# EAGLE design EIT (EAGLE 7.7.0)
DATABASE: /Users/jeanrintoul/Desktop/biomedicalimaging/EE/Eagle/EIT/partsdb.txt

## Sheet 1 of 8
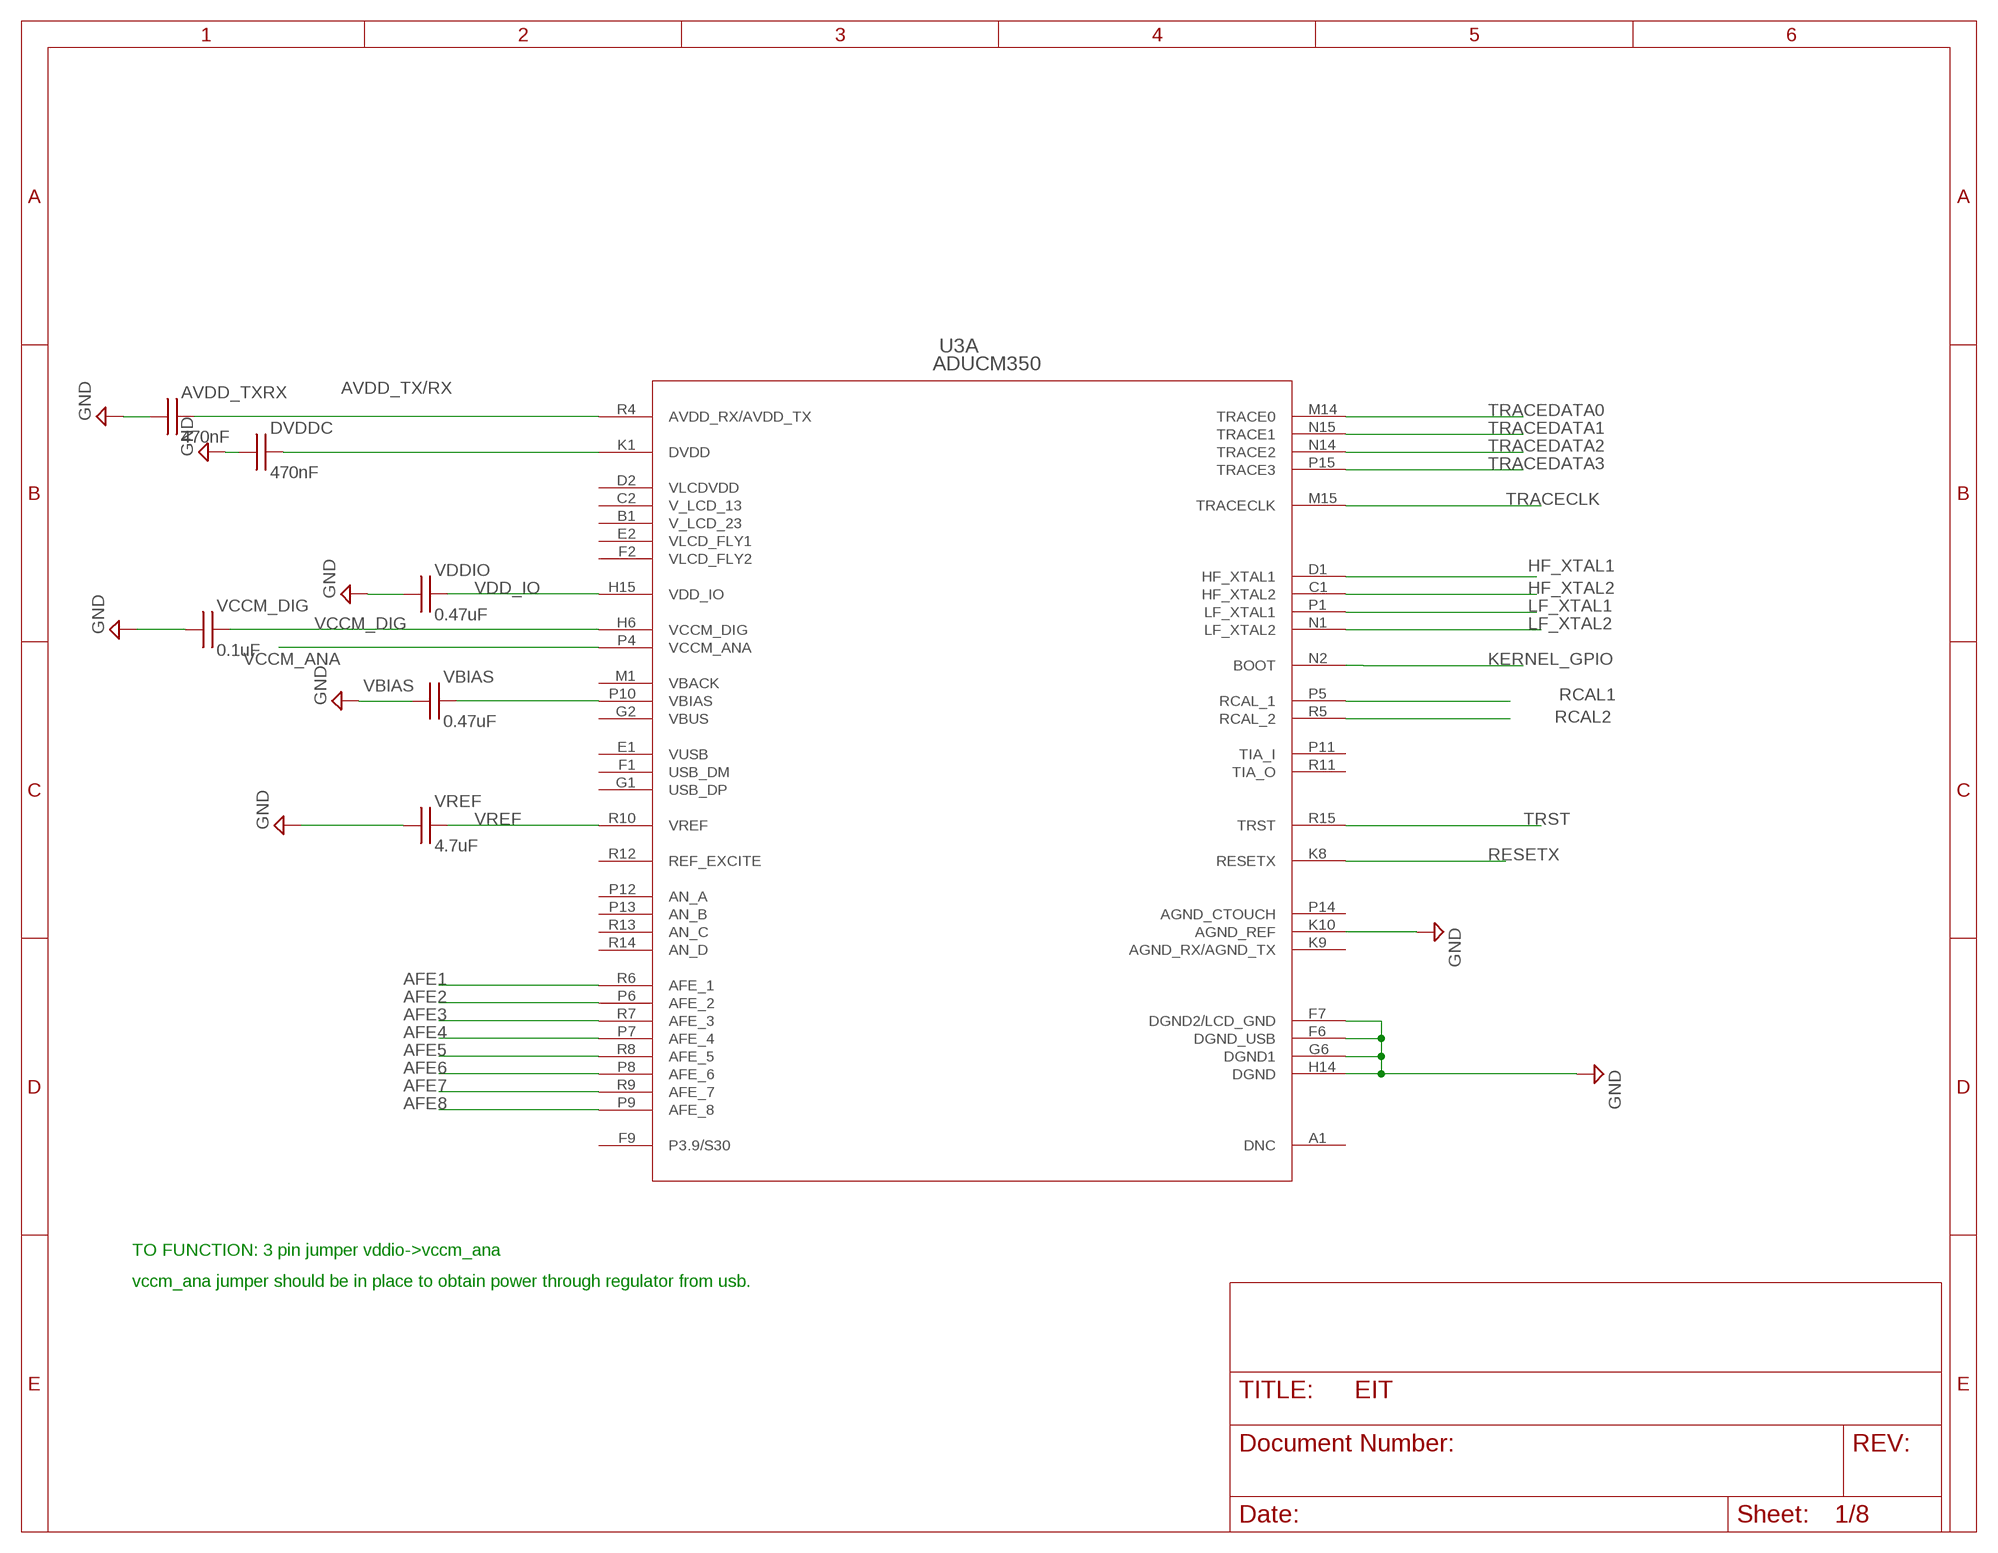
[diagram p0: schematic, sheet 1]

### Parts
AVDD_TXRX  470nF  CAPACITOR-NON-POLAR-0603  [CAPC1608X87N]
DVDDC  470nF  CAPACITOR-NON-POLAR-0603  [CAPC1608X87N]
U3  ADUCM350  [ADUCM350_DUNCAN]
VBIAS  0.47uF  CAPACITOR-NON-POLAR-0603  [CAPC1608X87N]
VCCM_DIG  0.1uF  CAPACITOR-NON-POLAR-0603  [CAPC1608X87N]
VDDIO  0.47uF  CAPACITOR-NON-POLAR-0603  [CAPC1608X87N]
VREF  4.7uF  CAPACITOR-NON-POLAR-0603  [CAPC1608X87N]

### Nets
AFE1: U3.R6(A:AFE_1) ; also sheet 6
AFE2: U3.P6(A:AFE_2) ; also sheet 6
AFE3: U3.R7(A:AFE_3) ; also sheet 5,6
AFE4: U3.P7(A:AFE_4) ; also sheet 5,6
AFE5: U3.R8(A:AFE_5) ; also sheet 6
AFE6: U3.P8(A:AFE_6) ; also sheet 6
AFE7: U3.R9(A:AFE_7) ; also sheet 6
AFE8: U3.P9(A:AFE_8) ; also sheet 6
AVDD_TX/RX: AVDD_TXRX.2 U3.R4(A:AVDD_RX/AVDD_TX)
GND: AVDD_TXRX.1 DVDDC.1 U3.F6(A:DGND_USB) U3.F7(A:DGND2/LCD_GND) U3.G6(A:DGND1) U3.H14(A:DGND) U3.K10(A:AGND_REF) VBIAS.1 VCCM_DIG.1 VDDIO.1 VREF.1 ; also sheet 3,4,5,6,7,8
HF_XTAL1: U3.D1(A:HF_XTAL1) ; also sheet 7
HF_XTAL2: U3.C1(A:HF_XTAL2) ; also sheet 7
KERNEL_GPIO: U3.N2(A:BOOT) ; also sheet 4
LF_XTAL1: U3.P1(A:LF_XTAL1) ; also sheet 7
LF_XTAL2: U3.N1(A:LF_XTAL2) ; also sheet 7
RCAL1: U3.P5(A:RCAL_1) ; also sheet 5
RCAL2: U3.R5(A:RCAL_2) ; also sheet 5
RESETX: U3.K8(A:RESETX) ; also sheet 4,8
TRACECLK: U3.M15(A:TRACECLK) ; also sheet 7
TRACEDATA0: U3.M14(A:TRACE0) ; also sheet 7
TRACEDATA1: U3.N15(A:TRACE1) ; also sheet 7
TRACEDATA2: U3.N14(A:TRACE2) ; also sheet 7
TRACEDATA3: U3.P15(A:TRACE3) ; also sheet 7
TRST: U3.R15(A:TRST) ; also sheet 7
VBIAS: U3.P10(A:VBIAS) VBIAS.2
VCCM_ANA: U3.P4(A:VCCM_ANA) ; also sheet 3,5,6,7
VCCM_DIG: U3.H6(A:VCCM_DIG) VCCM_DIG.2
VDD_IO: U3.H15(A:VDD_IO) VDDIO.2 ; also sheet 7
VLCDVDD: DVDDC.2 U3.K1(A:DVDD)
VREF: U3.R10(A:VREF) VREF.2
Unconnected: U3.A1(A:DNC) U3.B1(A:V_LCD_23) U3.C2(A:V_LCD_13) U3.D2(A:VLCDVDD) U3.E1(A:VUSB) U3.E2(A:VLCD_FLY1) U3.F1(A:USB_DM) U3.F2(A:VLCD_FLY2) U3.F9(A:P3.9/S30) U3.G1(A:USB_DP) U3.G2(A:VBUS) U3.K9(A:AGND_RX/AGND_TX) U3.M1(A:VBACK) U3.P11(A:TIA_I) U3.P12(A:AN_A) U3.P13(A:AN_B) U3.P14(A:AGND_CTOUCH) U3.R11(A:TIA_O) U3.R12(A:REF_EXCITE) U3.R13(A:AN_C) U3.R14(A:AN_D)

### Notes on the sheet
- TO FUNCTION: 3 pin jumper vddio->vccm_ana
- vccm_ana jumper should be in place to obtain power through regulator from usb.

## Sheet 2 of 8
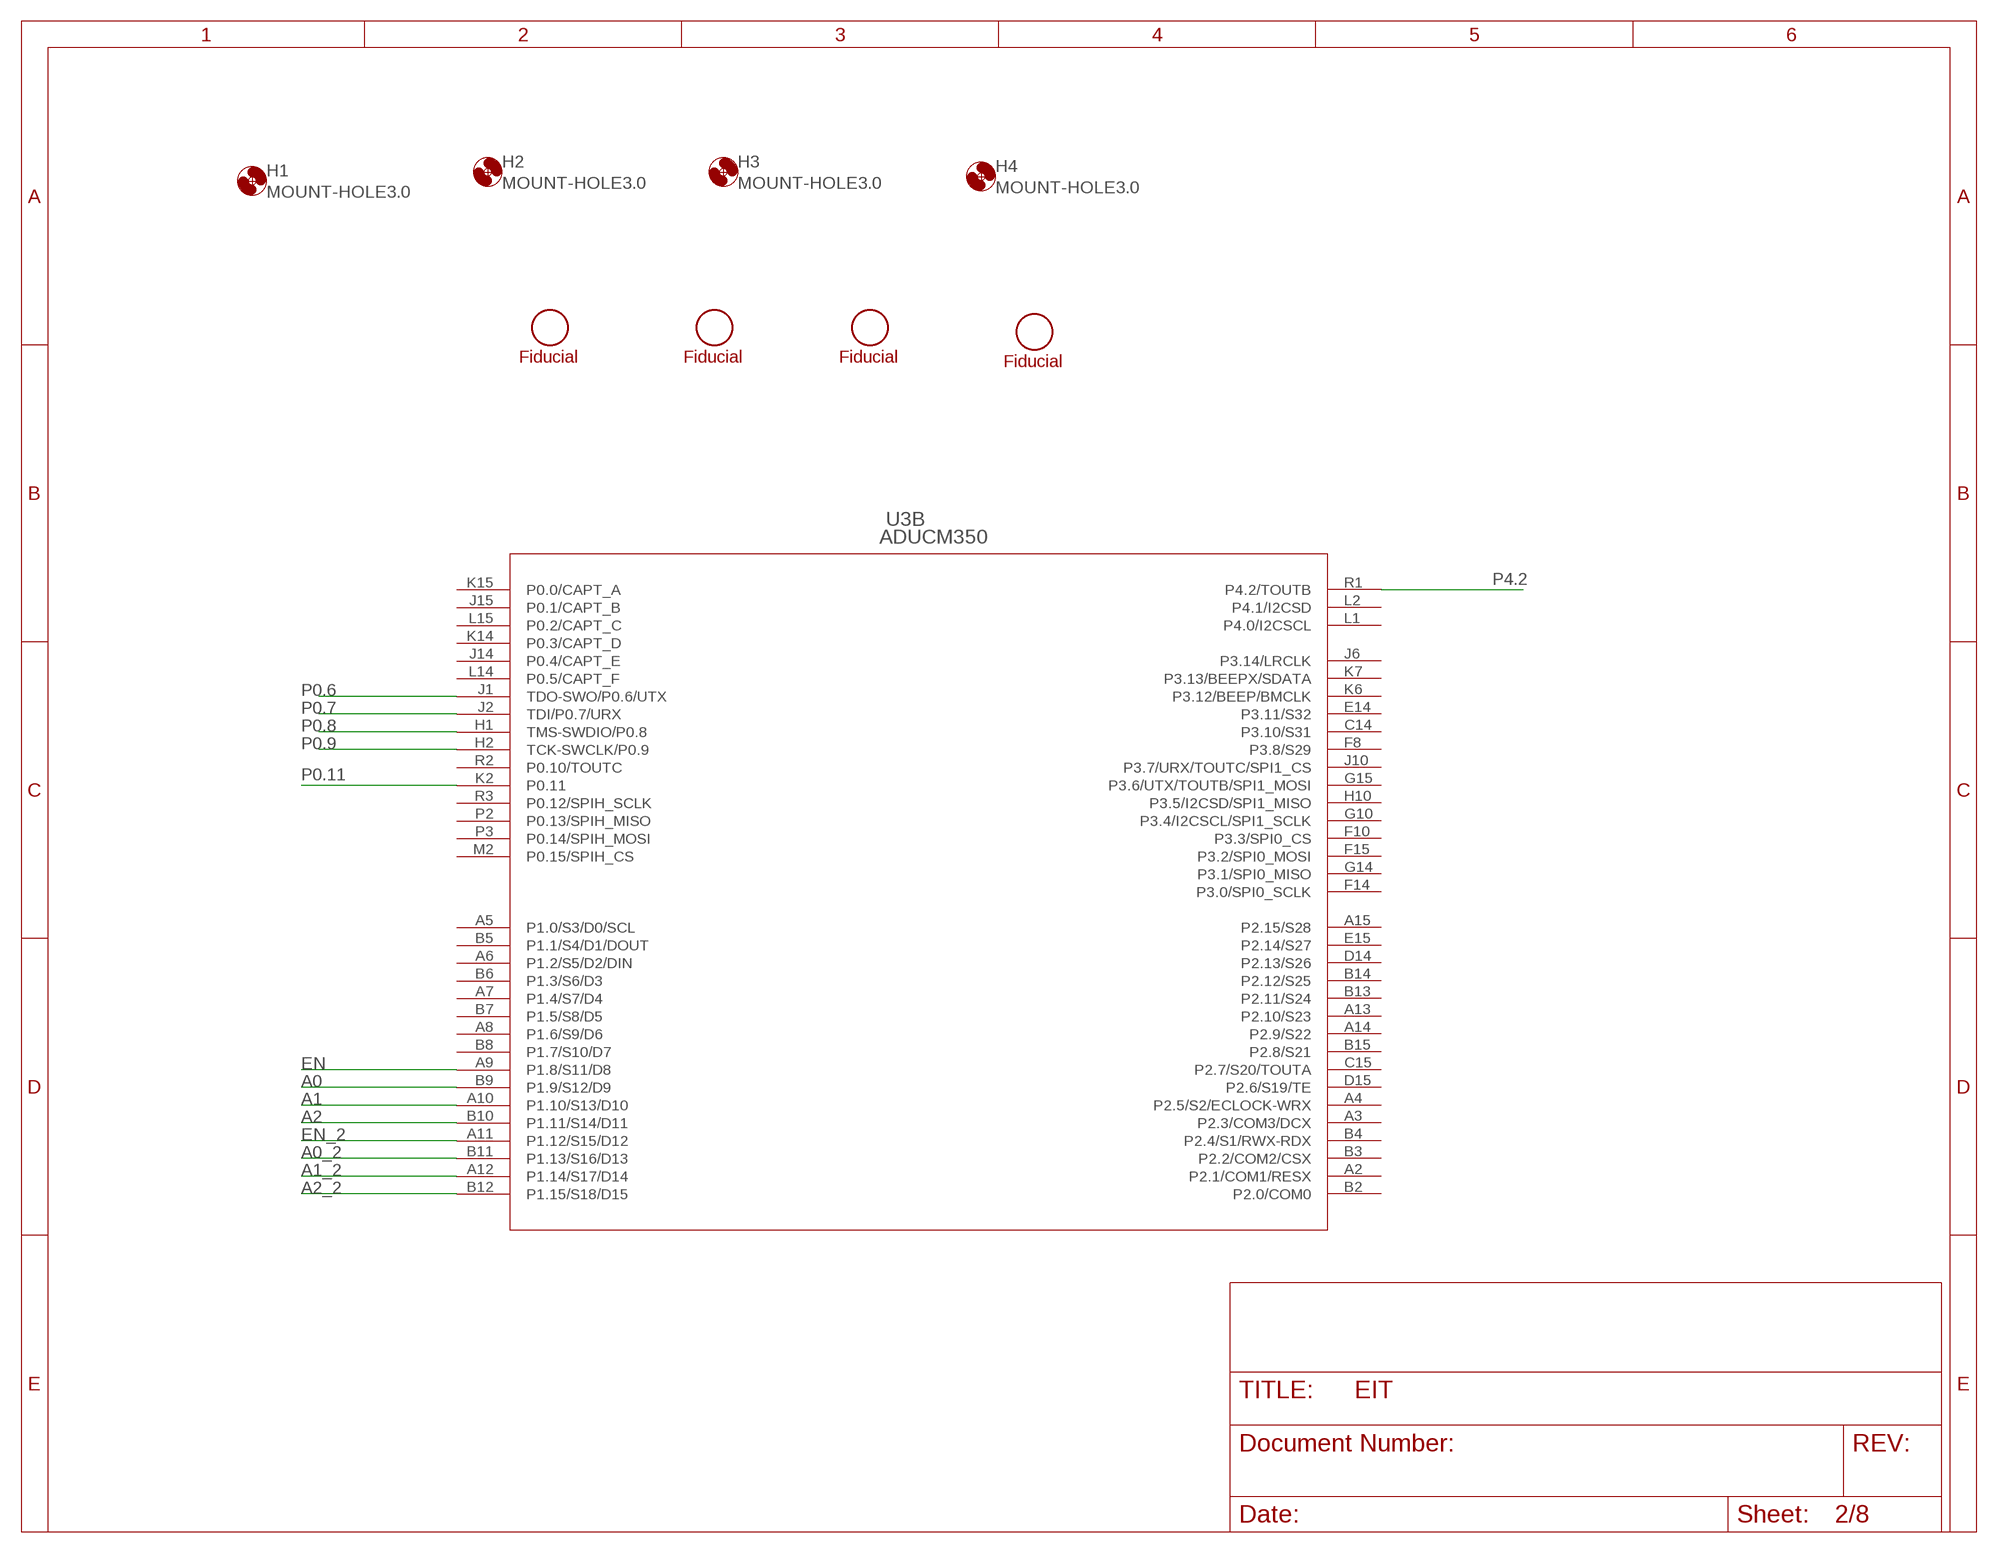
[diagram p1: schematic, sheet 2]

### Parts
F1  FIDUCIAL  [FIDUCIAL-1MM]
F2  FIDUCIAL  [FIDUCIAL-1MM]
F3  FIDUCIAL  [FIDUCIAL-1MM]
F4  FIDUCIAL  [FIDUCIAL-1MM]
H1  MOUNT-HOLE3.0  [3,0]
H2  MOUNT-HOLE3.0  [3,0]
H3  MOUNT-HOLE3.0  [3,0]
H4  MOUNT-HOLE3.0  [3,0]

### Nets
A0: U3.B9(B:P1.9/S12/D9) ; also sheet 5
A0_2: U3.B11(B:P1.13/S16/D13) ; also sheet 5
A1: U3.A10(B:P1.10/S13/D10) ; also sheet 5
A1_2: U3.A12(B:P1.14/S17/D14) ; also sheet 5
A2: U3.B10(B:P1.11/S14/D11) ; also sheet 5
A2_2: U3.B12(B:P1.15/S18/D15) ; also sheet 5
EN: U3.A9(B:P1.8/S11/D8) ; also sheet 5
EN_2: U3.A11(B:P1.12/S15/D12) ; also sheet 5
P0.6: U3.J1(B:TDO-SWO/P0.6/UTX) ; also sheet 4,7
P0.7: U3.J2(B:TDI/P0.7/URX) ; also sheet 4,7
P0.8: U3.H1(B:TMS-SWDIO/P0.8) ; also sheet 4,7
P0.9: U3.H2(B:TCK-SWCLK/P0.9) ; also sheet 4,7
P0.11: U3.K2(B:P0.11) ; also sheet 4
P4.2: U3.R1(B:P4.2/TOUTB) ; also sheet 4
Unconnected: U3.A2(B:P2.1/COM1/RESX) U3.A3(B:P2.3/COM3/DCX) U3.A4(B:P2.5/S2/ECLOCK-WRX) U3.A5(B:P1.0/S3/D0/SCL) U3.A6(B:P1.2/S5/D2/DIN) U3.A7(B:P1.4/S7/D4) U3.A8(B:P1.6/S9/D6) U3.A13(B:P2.10/S23) U3.A14(B:P2.9/S22) U3.A15(B:P2.15/S28) U3.B2(B:P2.0/COM0) U3.B3(B:P2.2/COM2/CSX) U3.B4(B:P2.4/S1/RWX-RDX) U3.B5(B:P1.1/S4/D1/DOUT) U3.B6(B:P1.3/S6/D3) U3.B7(B:P1.5/S8/D5) U3.B8(B:P1.7/S10/D7) U3.B13(B:P2.11/S24) U3.B14(B:P2.12/S25) U3.B15(B:P2.8/S21) U3.C14(B:P3.10/S31) U3.C15(B:P2.7/S20/TOUTA) U3.D14(B:P2.13/S26) U3.D15(B:P2.6/S19/TE) U3.E14(B:P3.11/S32) U3.E15(B:P2.14/S27) U3.F8(B:P3.8/S29) U3.F10(B:P3.3/SPI0_CS) U3.F14(B:P3.0/SPI0_SCLK) U3.F15(B:P3.2/SPI0_MOSI) U3.G10(B:P3.4/I2CSCL/SPI1_SCLK) U3.G14(B:P3.1/SPI0_MISO) U3.G15(B:P3.6/UTX/TOUTB/SPI1_MOSI) U3.H10(B:P3.5/I2CSD/SPI1_MISO) U3.J6(B:P3.14/LRCLK) U3.J10(B:P3.7/URX/TOUTC/SPI1_CS) U3.J14(B:P0.4/CAPT_E) U3.J15(B:P0.1/CAPT_B) U3.K6(B:P3.12/BEEP/BMCLK) U3.K7(B:P3.13/BEEPX/SDATA) U3.K14(B:P0.3/CAPT_D) U3.K15(B:P0.0/CAPT_A) U3.L1(B:P4.0/I2CSCL) U3.L2(B:P4.1/I2CSD) U3.L14(B:P0.5/CAPT_F) U3.L15(B:P0.2/CAPT_C) U3.M2(B:P0.15/SPIH_CS) U3.P2(B:P0.13/SPIH_MISO) U3.P3(B:P0.14/SPIH_MOSI) U3.R2(B:P0.10/TOUTC) U3.R3(B:P0.12/SPIH_SCLK)

## Sheet 3 of 8
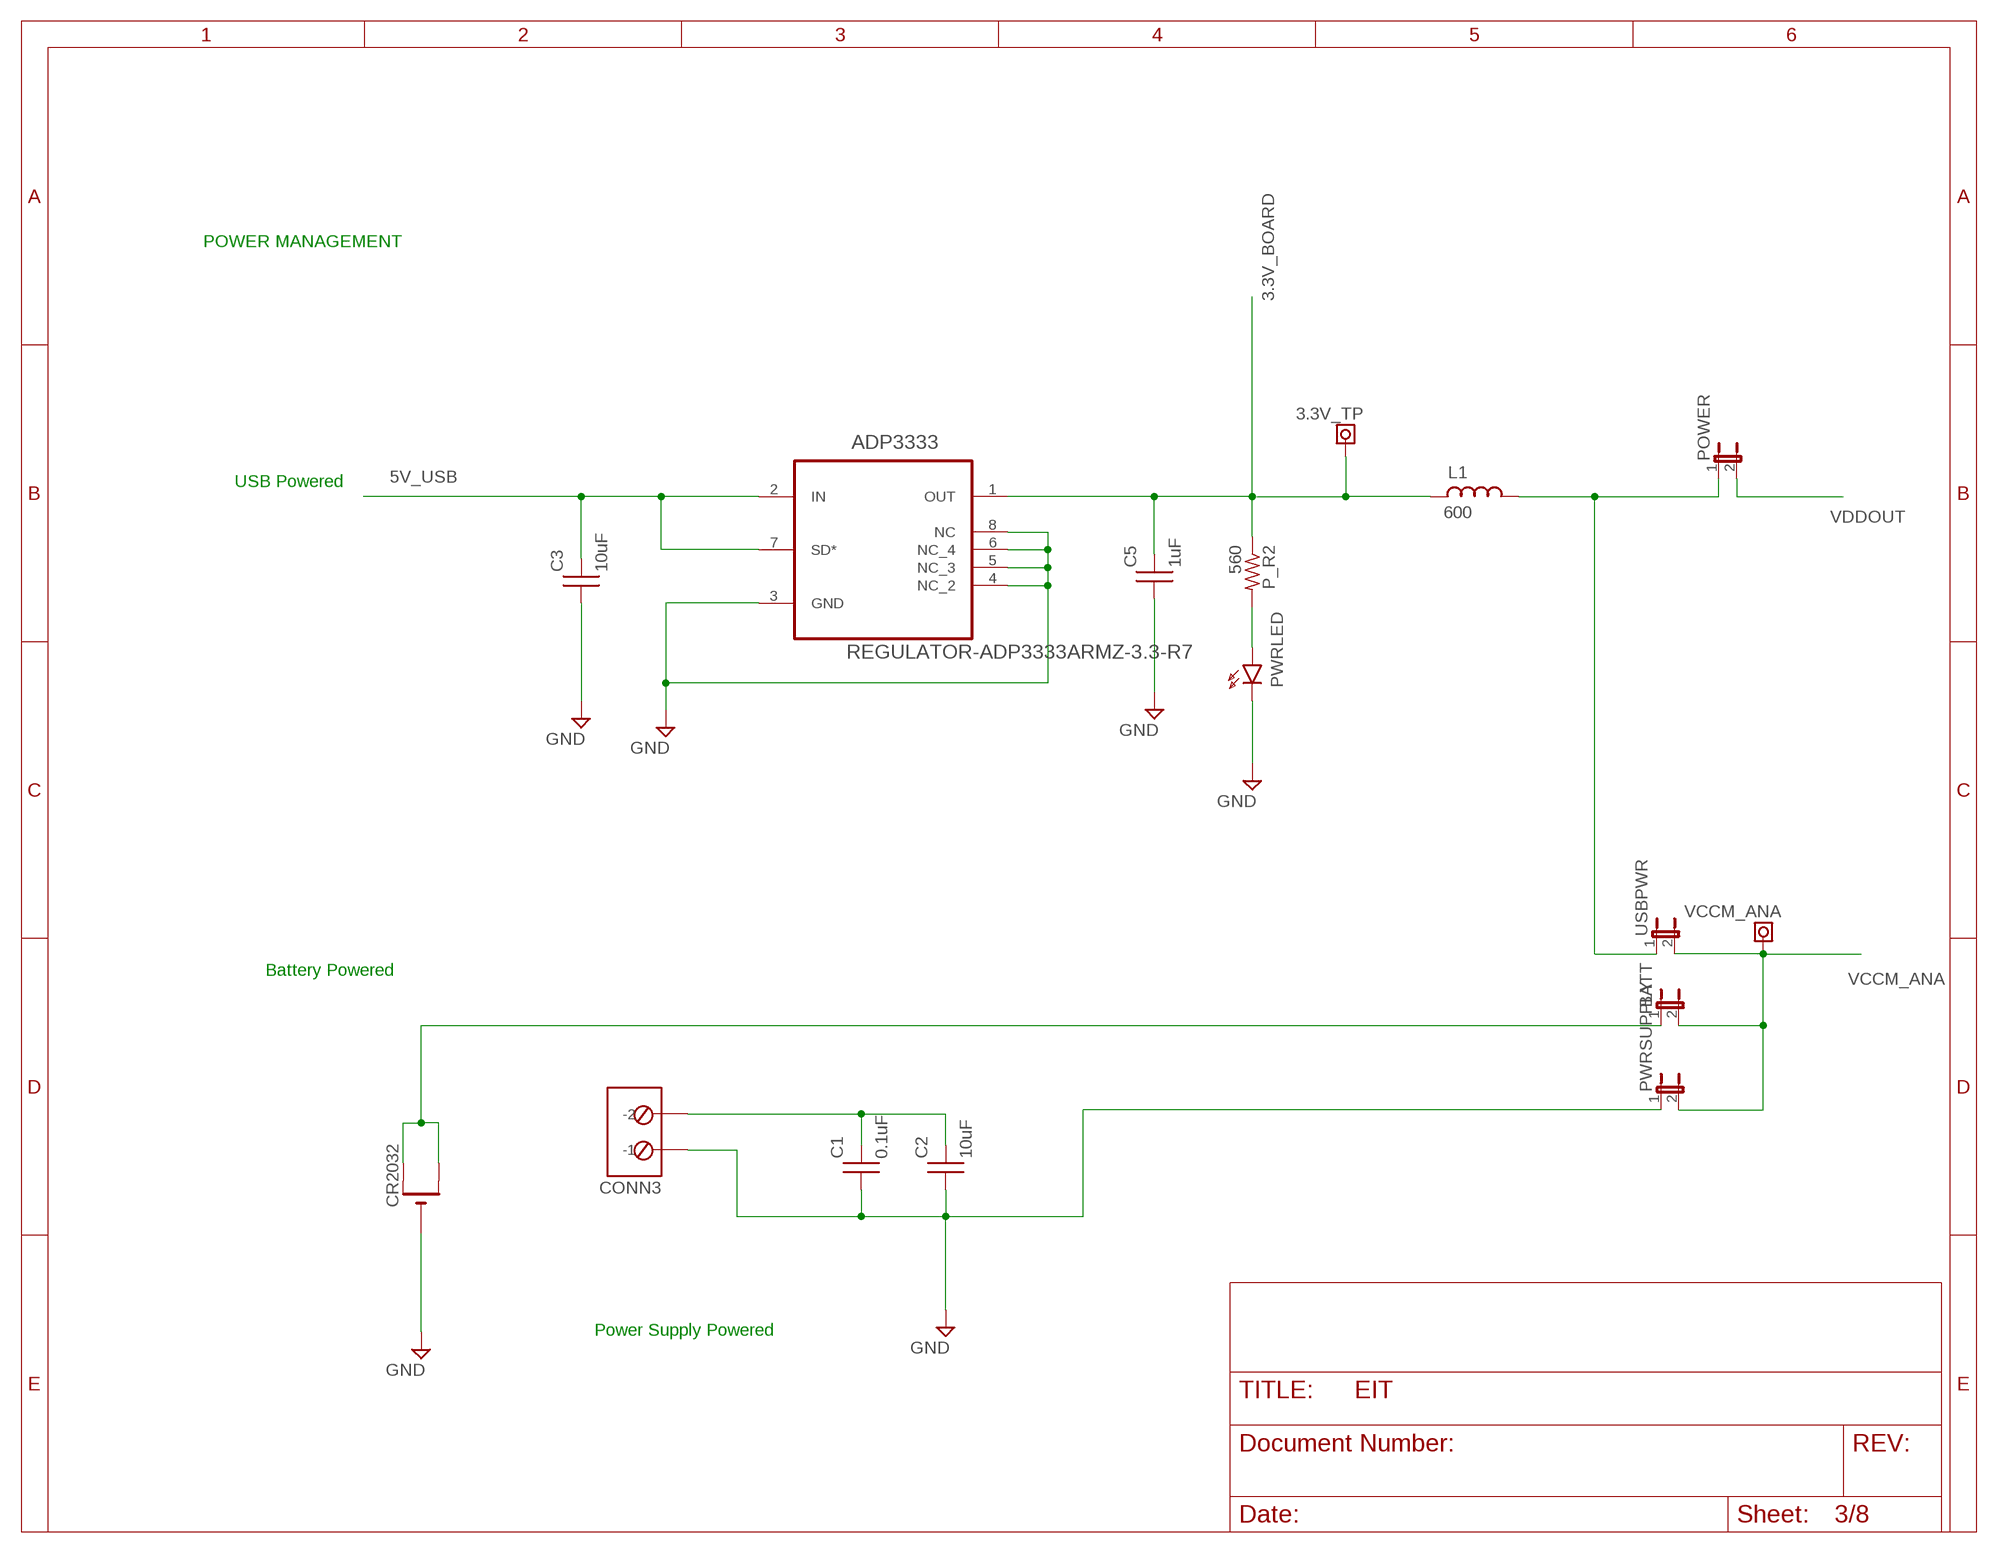
[diagram p2: schematic, sheet 3]

### Parts
3.3V_TP  TEST_POINT-TEST_POINTMINI  [TP-MINI]
ADP3333  REGULATOR-ADP3333ARMZ-3.3-R7  [SOP65P490X110-8N]
BATT  JUMPER-2PTH  [1X02]
C1  0.1uF  CAPACITOR-NON-POLAR-0603  [CAPC1608X87N]
C2  10uF  CAPACITOR-NON-POLAR-0603  [CAPC1608X87N]
C3  10uF  CAPACITOR-NON-POLAR-0603  [CAPC1608X87N]
C5  1uF  CAPACITOR-NON-POLAR-0603  [CAPC1608X87N]
CONN3  MKDSN2  [MKDSN2]
CR2032  CR2032SMT  [CR2032-SMD]
L1  600  INDUCTOR-0603  [CAPC1608X87N]
P_R2  560  RESISTOR-US-0603(1608METRIC)  [RES1608X55]
POWER  JUMPER-2PTH  [1X02]
PWRLED  LED-0603  [0603_LED]
PWRSUPPLY  JUMPER-2PTH  [1X02]
USBPWR  JUMPER-2PTH  [1X02]
VCCM_ANA  TEST_POINT-TEST_POINTMINI  [TP-MINI]

### Nets
3.3V_BOARD: ADP3333.1(OUT) C5.2 P_R2.2 ; also sheet 4,7,8
5V_USB: ADP3333.2(IN) ADP3333.7(SD*) C3.2 ; also sheet 4
GND: ADP3333.3(GND) ADP3333.4(NC_2) ADP3333.5(NC_3) ADP3333.6(NC_4) ADP3333.8(NC) C1.1 C2.1 C3.1 C5.1 CONN3.1(-1) CR2032.- PWRLED.C PWRSUPPLY.1 ; also sheet 1,4,5,6,7,8
N$5: P_R2.1 PWRLED.A
N$9: 3.3V_TP.1 L1.1
N$10: L1.2 POWER.1 USBPWR.1
N$12: BATT.1 CR2032.+$1(+) CR2032.+$2(+1)
N$32: C1.2 C2.2 CONN3.2(-2)
VCCM_ANA: BATT.2 PWRSUPPLY.2 USBPWR.2 VCCM_ANA.1 ; also sheet 1,5,6,7
VDDOUT: POWER.2 ; also sheet 4

### Notes on the sheet
- POWER MANAGEMENT
- USB Powered
- Battery Powered
- Power Supply Powered

## Sheet 4 of 8
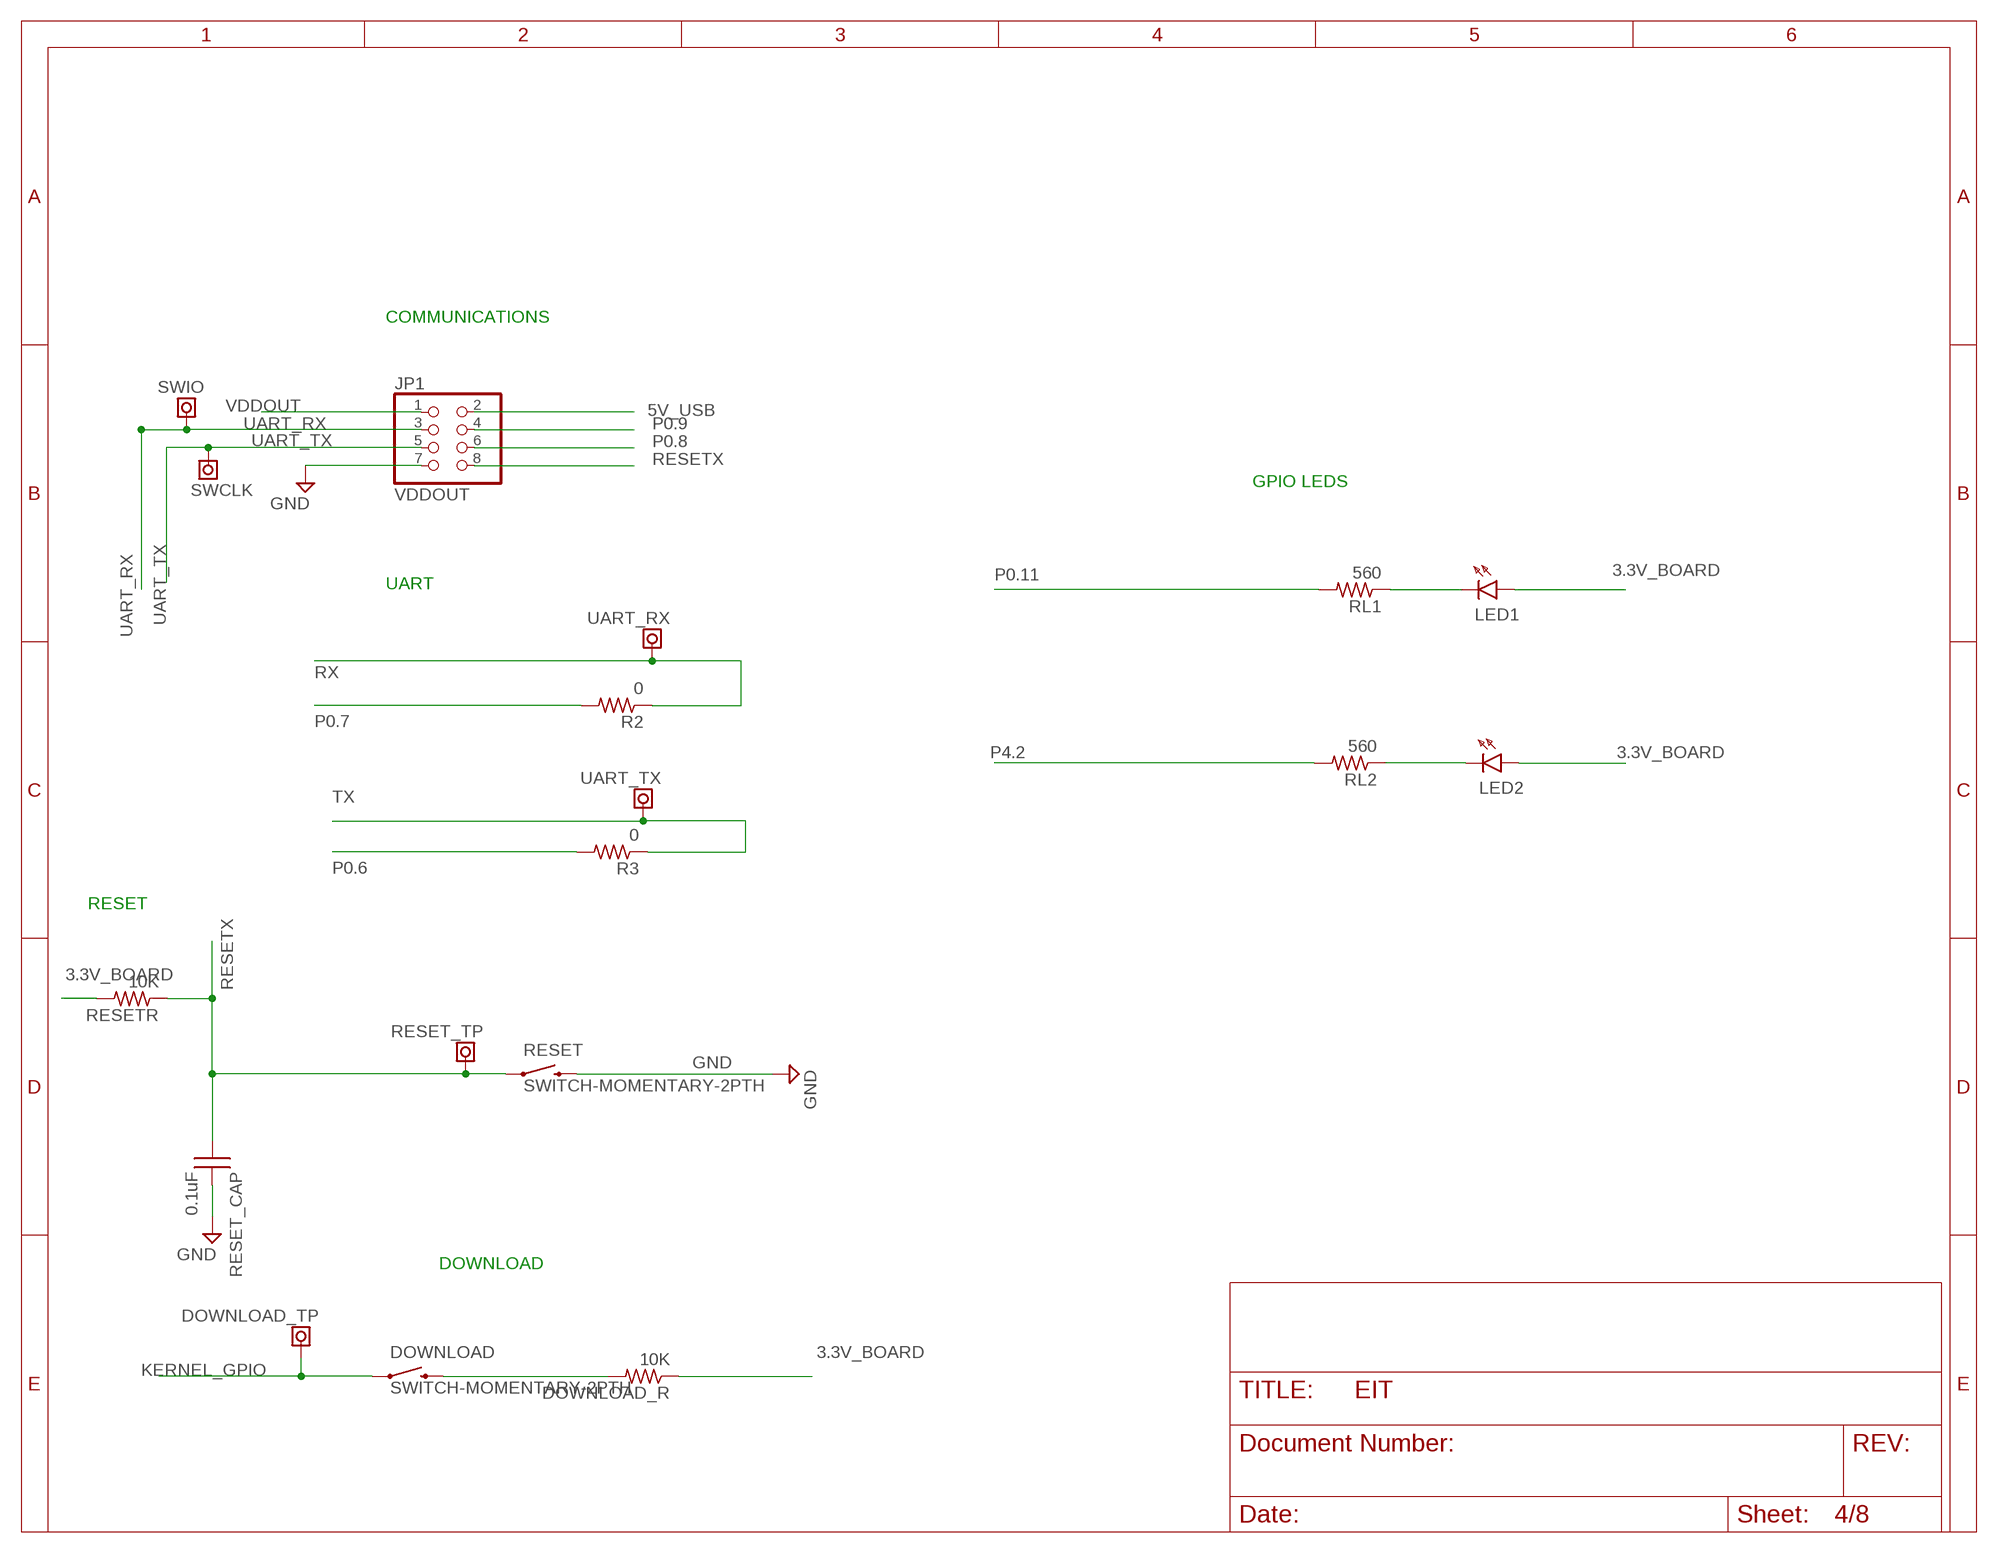
[diagram p3: schematic, sheet 4]

### Parts
DOWNLOAD  SWITCH-MOMENTARY-2PTH  [TACTILE-PTH]
DOWNLOAD_R  10K  RESISTOR-US-0603(1608METRIC)  [RES1608X55]
DOWNLOAD_TP  TEST_POINT-TEST_POINTMINI  [TP-MINI]
JP1  VDDOUT  PINHD-2X4/90  [2X04/90]
LED1  LED-0603  [0603_LED]
LED2  LED-0603  [0603_LED]
R2  0  RESISTOR-US-0603(1608METRIC)  [RES1608X55]
R3  0  RESISTOR-US-0603(1608METRIC)  [RES1608X55]
RESET  SWITCH-MOMENTARY-2PTH  [TACTILE-PTH]
RESET_CAP  0.1uF  CAPACITOR-NON-POLAR-0603  [CAPC1608X87N]
RESET_TP  TEST_POINT-TEST_POINTMINI  [TP-MINI]
RESETR  10K  RESISTOR-US-0603(1608METRIC)  [RES1608X55]
RL1  560  RESISTOR-US-0603(1608METRIC)  [RES1608X55]
RL2  560  RESISTOR-US-0603(1608METRIC)  [RES1608X55]
SWCLK  TEST_POINT-TEST_POINTMINI  [TP-MINI]
SWIO  TEST_POINT-TEST_POINTMINI  [TP-MINI]
UART_RX  TEST_POINT-TEST_POINTMINI  [TP-MINI]
UART_TX  TEST_POINT-TEST_POINTMINI  [TP-MINI]

### Nets
3.3V_BOARD: DOWNLOAD_R.2 LED1.A LED2.A RESETR.1 ; also sheet 3,7,8
5V_USB: JP1.2 ; also sheet 3
GND: JP1.7 RESET.3 RESET_CAP.2 ; also sheet 1,3,5,6,7,8
KERNEL_GPIO: DOWNLOAD.1 DOWNLOAD_TP.1 ; also sheet 1
N$3: DOWNLOAD.3 DOWNLOAD_R.1
N$8: LED2.C RL2.2
N$11: LED1.C RL1.2
P0.6: R3.1 ; also sheet 2,7
P0.7: R2.1 ; also sheet 2,7
P0.8: JP1.6 ; also sheet 2,7
P0.9: JP1.4 ; also sheet 2,7
P0.11: RL1.1 ; also sheet 2
P4.2: RL2.1 ; also sheet 2
RESETX: JP1.8 RESET.1 RESET_CAP.1 RESET_TP.1 RESETR.2 ; also sheet 1,8
RX: R2.2 UART_RX.1 ; also sheet 8
TX: R3.2 UART_TX.1 ; also sheet 8
UART_RX: JP1.3 SWIO.1 ; also sheet 8
UART_TX: JP1.5 SWCLK.1 ; also sheet 8
VDDOUT: JP1.1 ; also sheet 3

### Notes on the sheet
- COMMUNICATIONS
- GPIO LEDS
- UART
- RESET
- DOWNLOAD

## Sheet 5 of 8
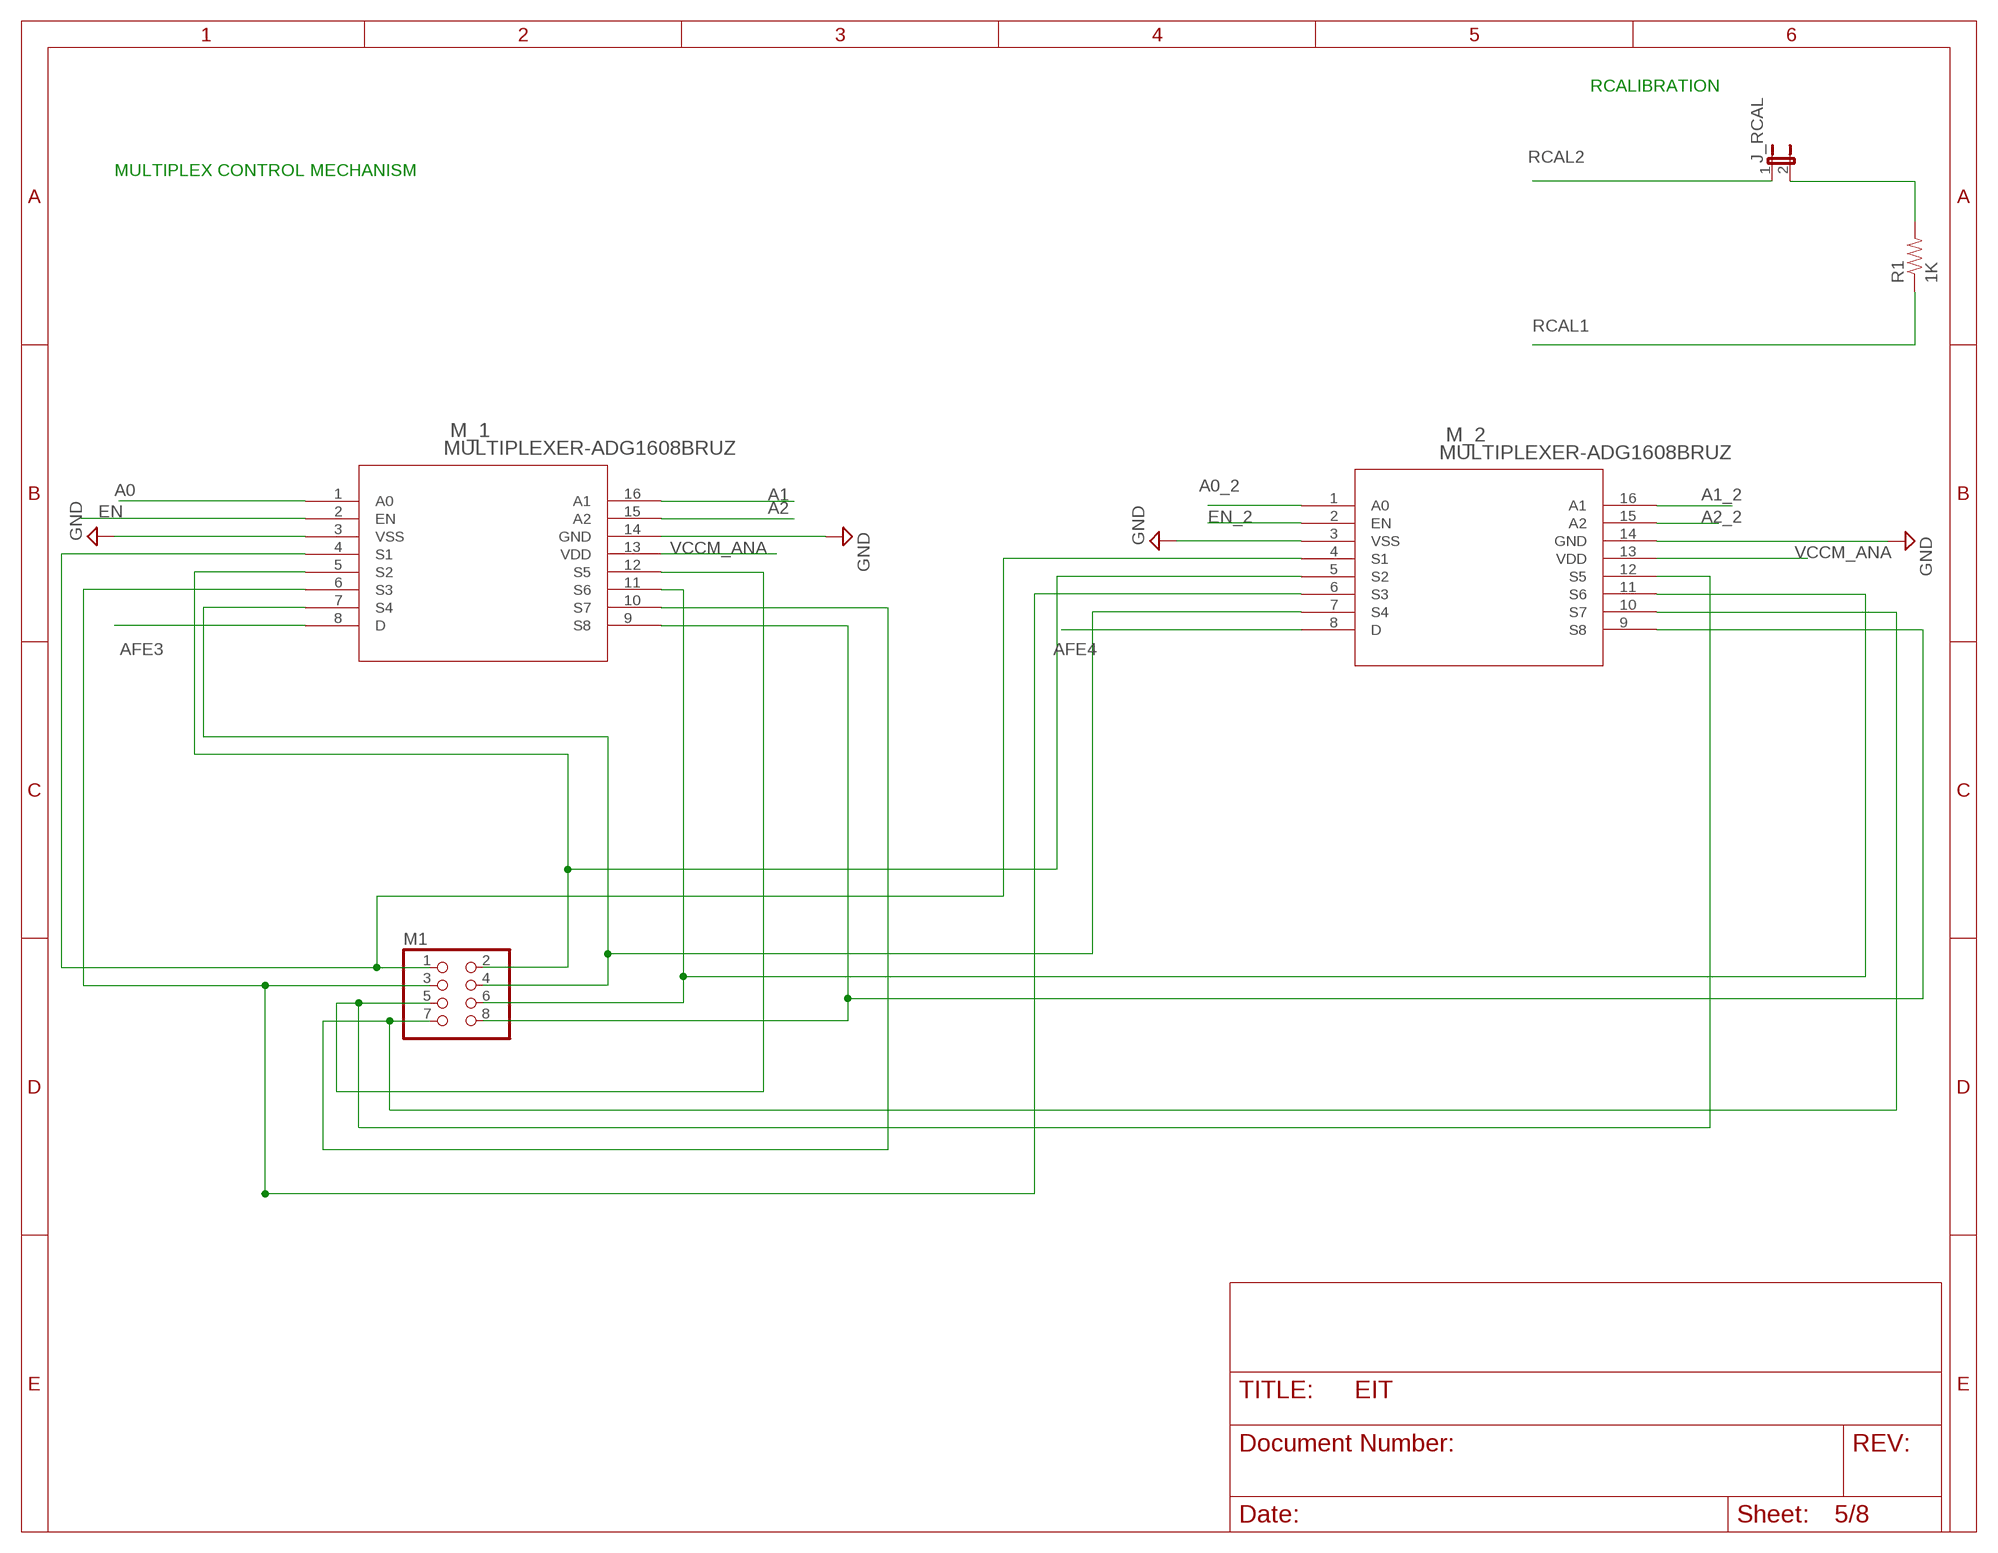
[diagram p4: schematic, sheet 5]

### Parts
J_RCAL  JUMPER-2PTH  [1X02]
M1  PINHD-2X42X04SHROUDED  [2X04SHROUDED]
M_1  MULTIPLEXER-ADG1608BRUZ  [RU_16]
M_2  MULTIPLEXER-ADG1608BRUZ  [RU_16]
R1  1K  RESISTOR0603  [0603-RES]

### Nets
A0: M_1.1(A0) ; also sheet 2
A0_2: M_2.1(A0) ; also sheet 2
A1: M_1.16(A1) ; also sheet 2
A1_2: M_2.16(A1) ; also sheet 2
A2: M_1.15(A2) ; also sheet 2
A2_2: M_2.15(A2) ; also sheet 2
AFE3: M_1.8(D) ; also sheet 1,6
AFE4: M_2.8(D) ; also sheet 1,6
EN: M_1.2(EN) ; also sheet 2
EN_2: M_2.2(EN) ; also sheet 2
GND: M_1.3(VSS) M_1.14(GND) M_2.3(VSS) M_2.14(GND) ; also sheet 1,3,4,6,7,8
M2_1: M1.1 M_1.4(S1) M_2.4(S1)
M2_2: M1.2 M_1.5(S2) M_2.5(S2)
M2_3: M1.3 M_1.6(S3) M_2.6(S3)
M2_4: M1.4 M_1.7(S4) M_2.7(S4)
M2_7: M1.7 M_1.10(S7) M_2.10(S7)
M2_8: M1.8 M_1.9(S8) M_2.9(S8)
N$6: M1.5 M_1.12(S5) M_2.12(S5)
N$17: J_RCAL.2 R1.2
N$29: M1.6 M_1.11(S6) M_2.11(S6)
RCAL1: R1.1 ; also sheet 1
RCAL2: J_RCAL.1 ; also sheet 1
VCCM_ANA: M_1.13(VDD) M_2.13(VDD) ; also sheet 1,3,6,7

### Notes on the sheet
- RCALIBRATION
- MULTIPLEX CONTROL MECHANISM

## Sheet 6 of 8
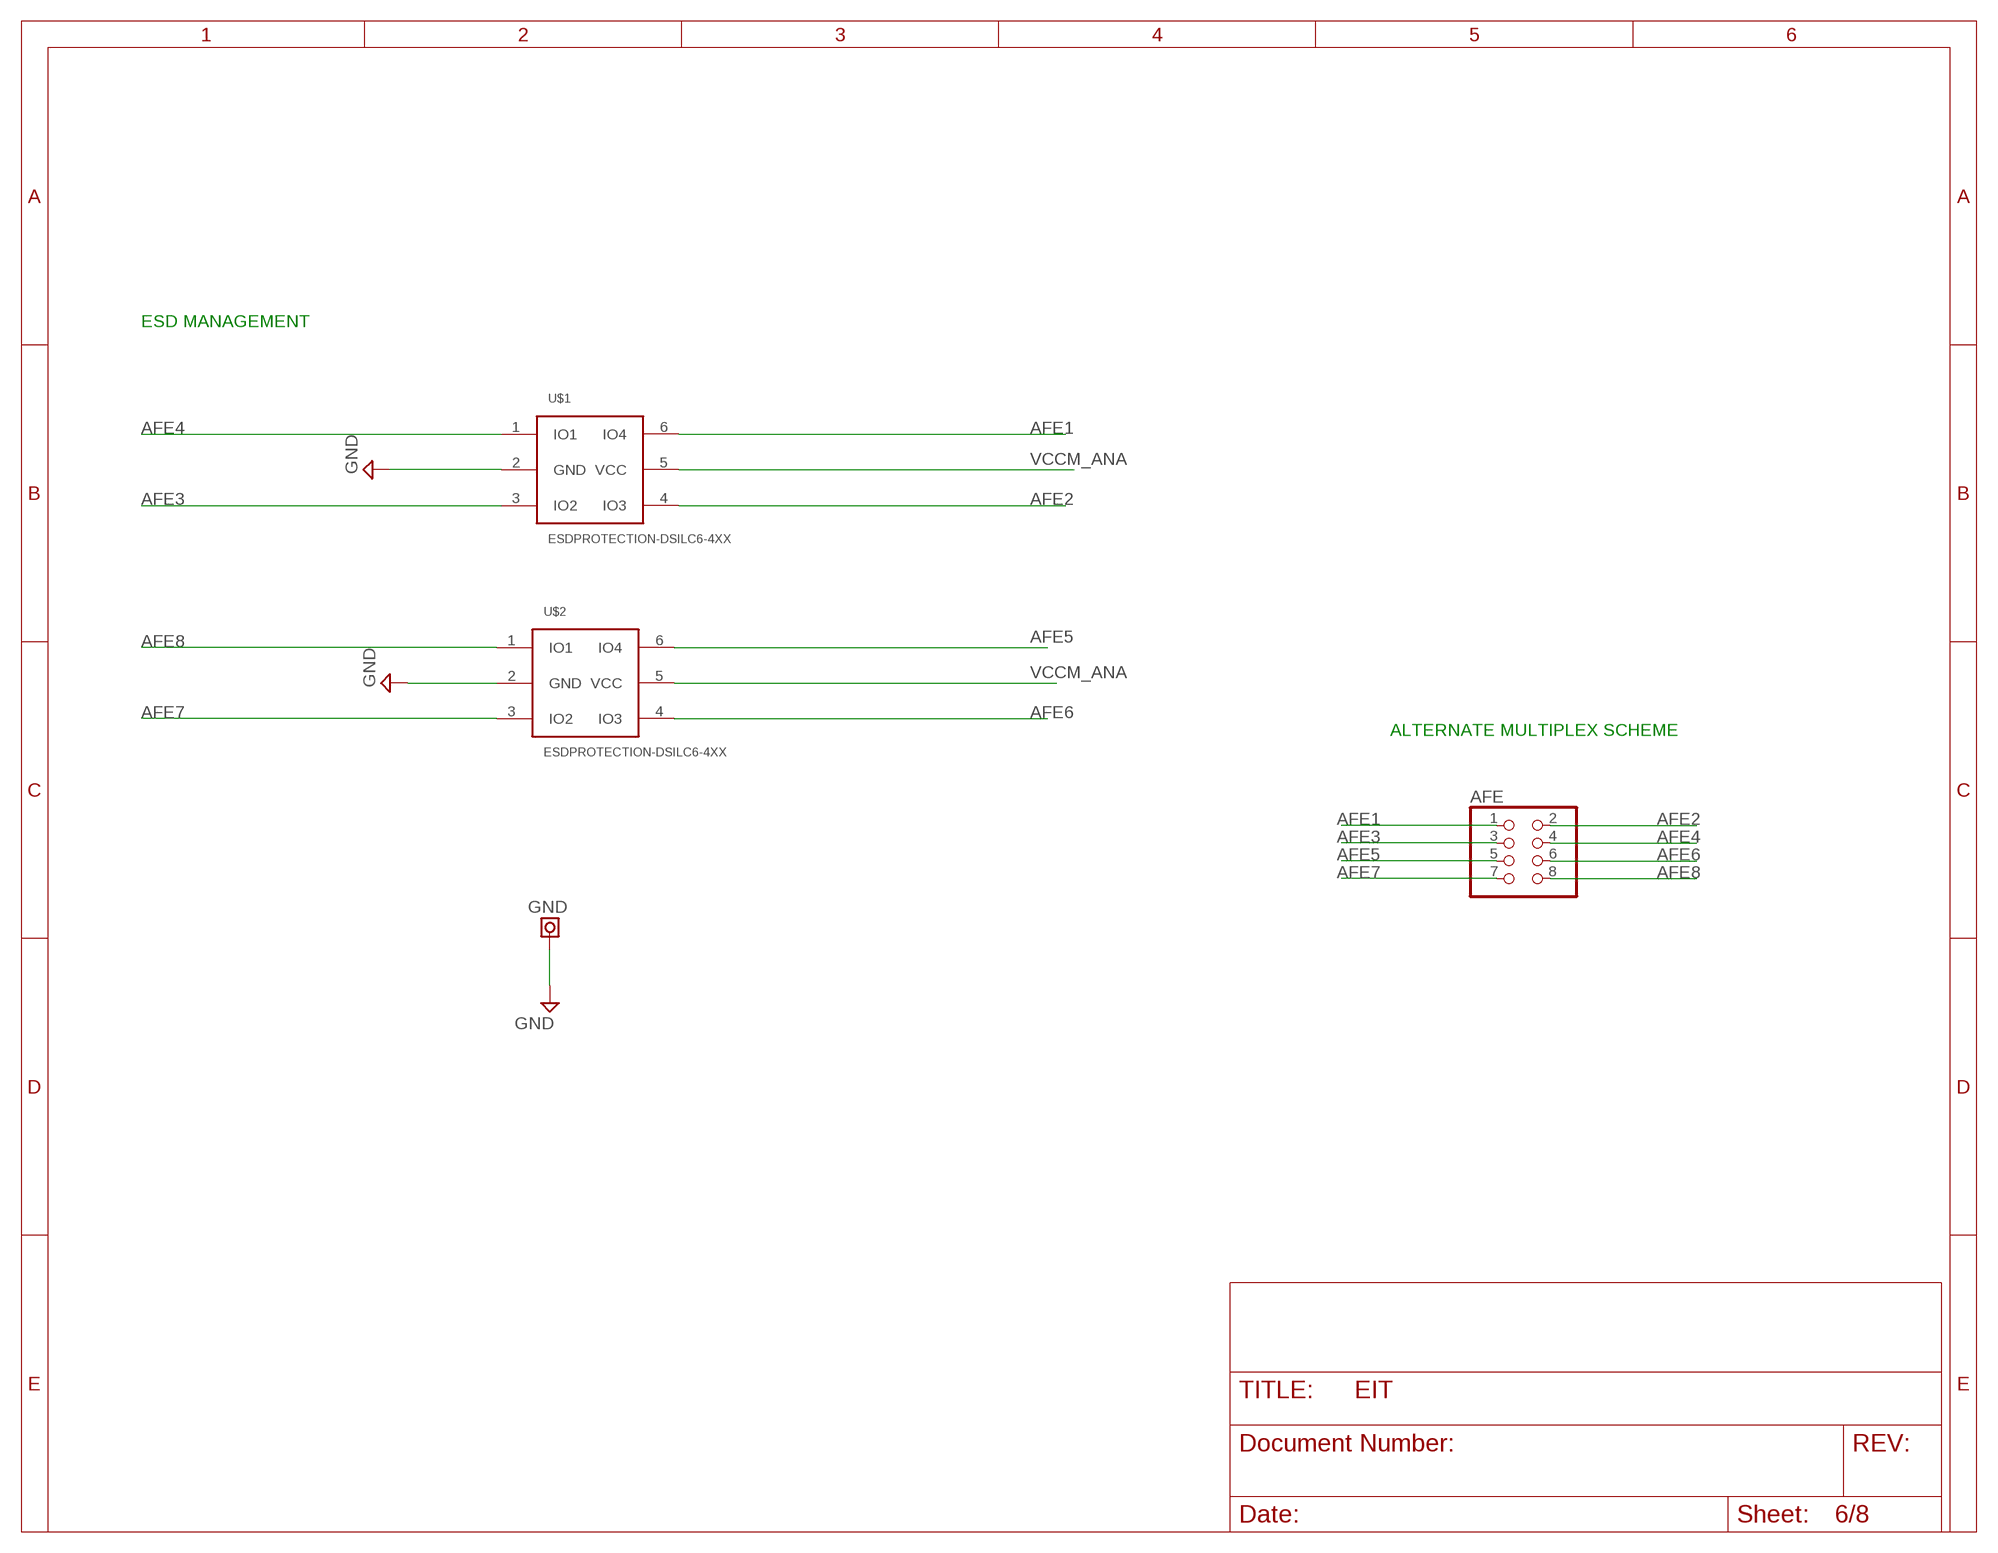
[diagram p5: schematic, sheet 6]

### Parts
AFE  PINHD-2X42X04SHROUDED  [2X04SHROUDED]
GND  TEST_POINT-TEST_POINTMINI  [TP-MINI]
U$1  ESDPROTECTION-DSILC6-4XX  [SOT-666]
U$2  ESDPROTECTION-DSILC6-4XX  [SOT-666]

### Nets
AFE1: AFE.1 U$1.6(IO4) ; also sheet 1
AFE2: AFE.2 U$1.4(IO3) ; also sheet 1
AFE3: AFE.3 U$1.3(IO2) ; also sheet 1,5
AFE4: AFE.4 U$1.1(IO1) ; also sheet 1,5
AFE5: AFE.5 U$2.6(IO4) ; also sheet 1
AFE6: AFE.6 U$2.4(IO3) ; also sheet 1
AFE7: AFE.7 U$2.3(IO2) ; also sheet 1
AFE8: AFE.8 U$2.1(IO1) ; also sheet 1
GND: GND.1 U$1.2(GND) U$2.2(GND) ; also sheet 1,3,4,5,7,8
VCCM_ANA: U$1.5(VCC) U$2.5(VCC) ; also sheet 1,3,5,7

### Notes on the sheet
- ESD MANAGEMENT
- ALTERNATE MULTIPLEX SCHEME

## Sheet 7 of 8
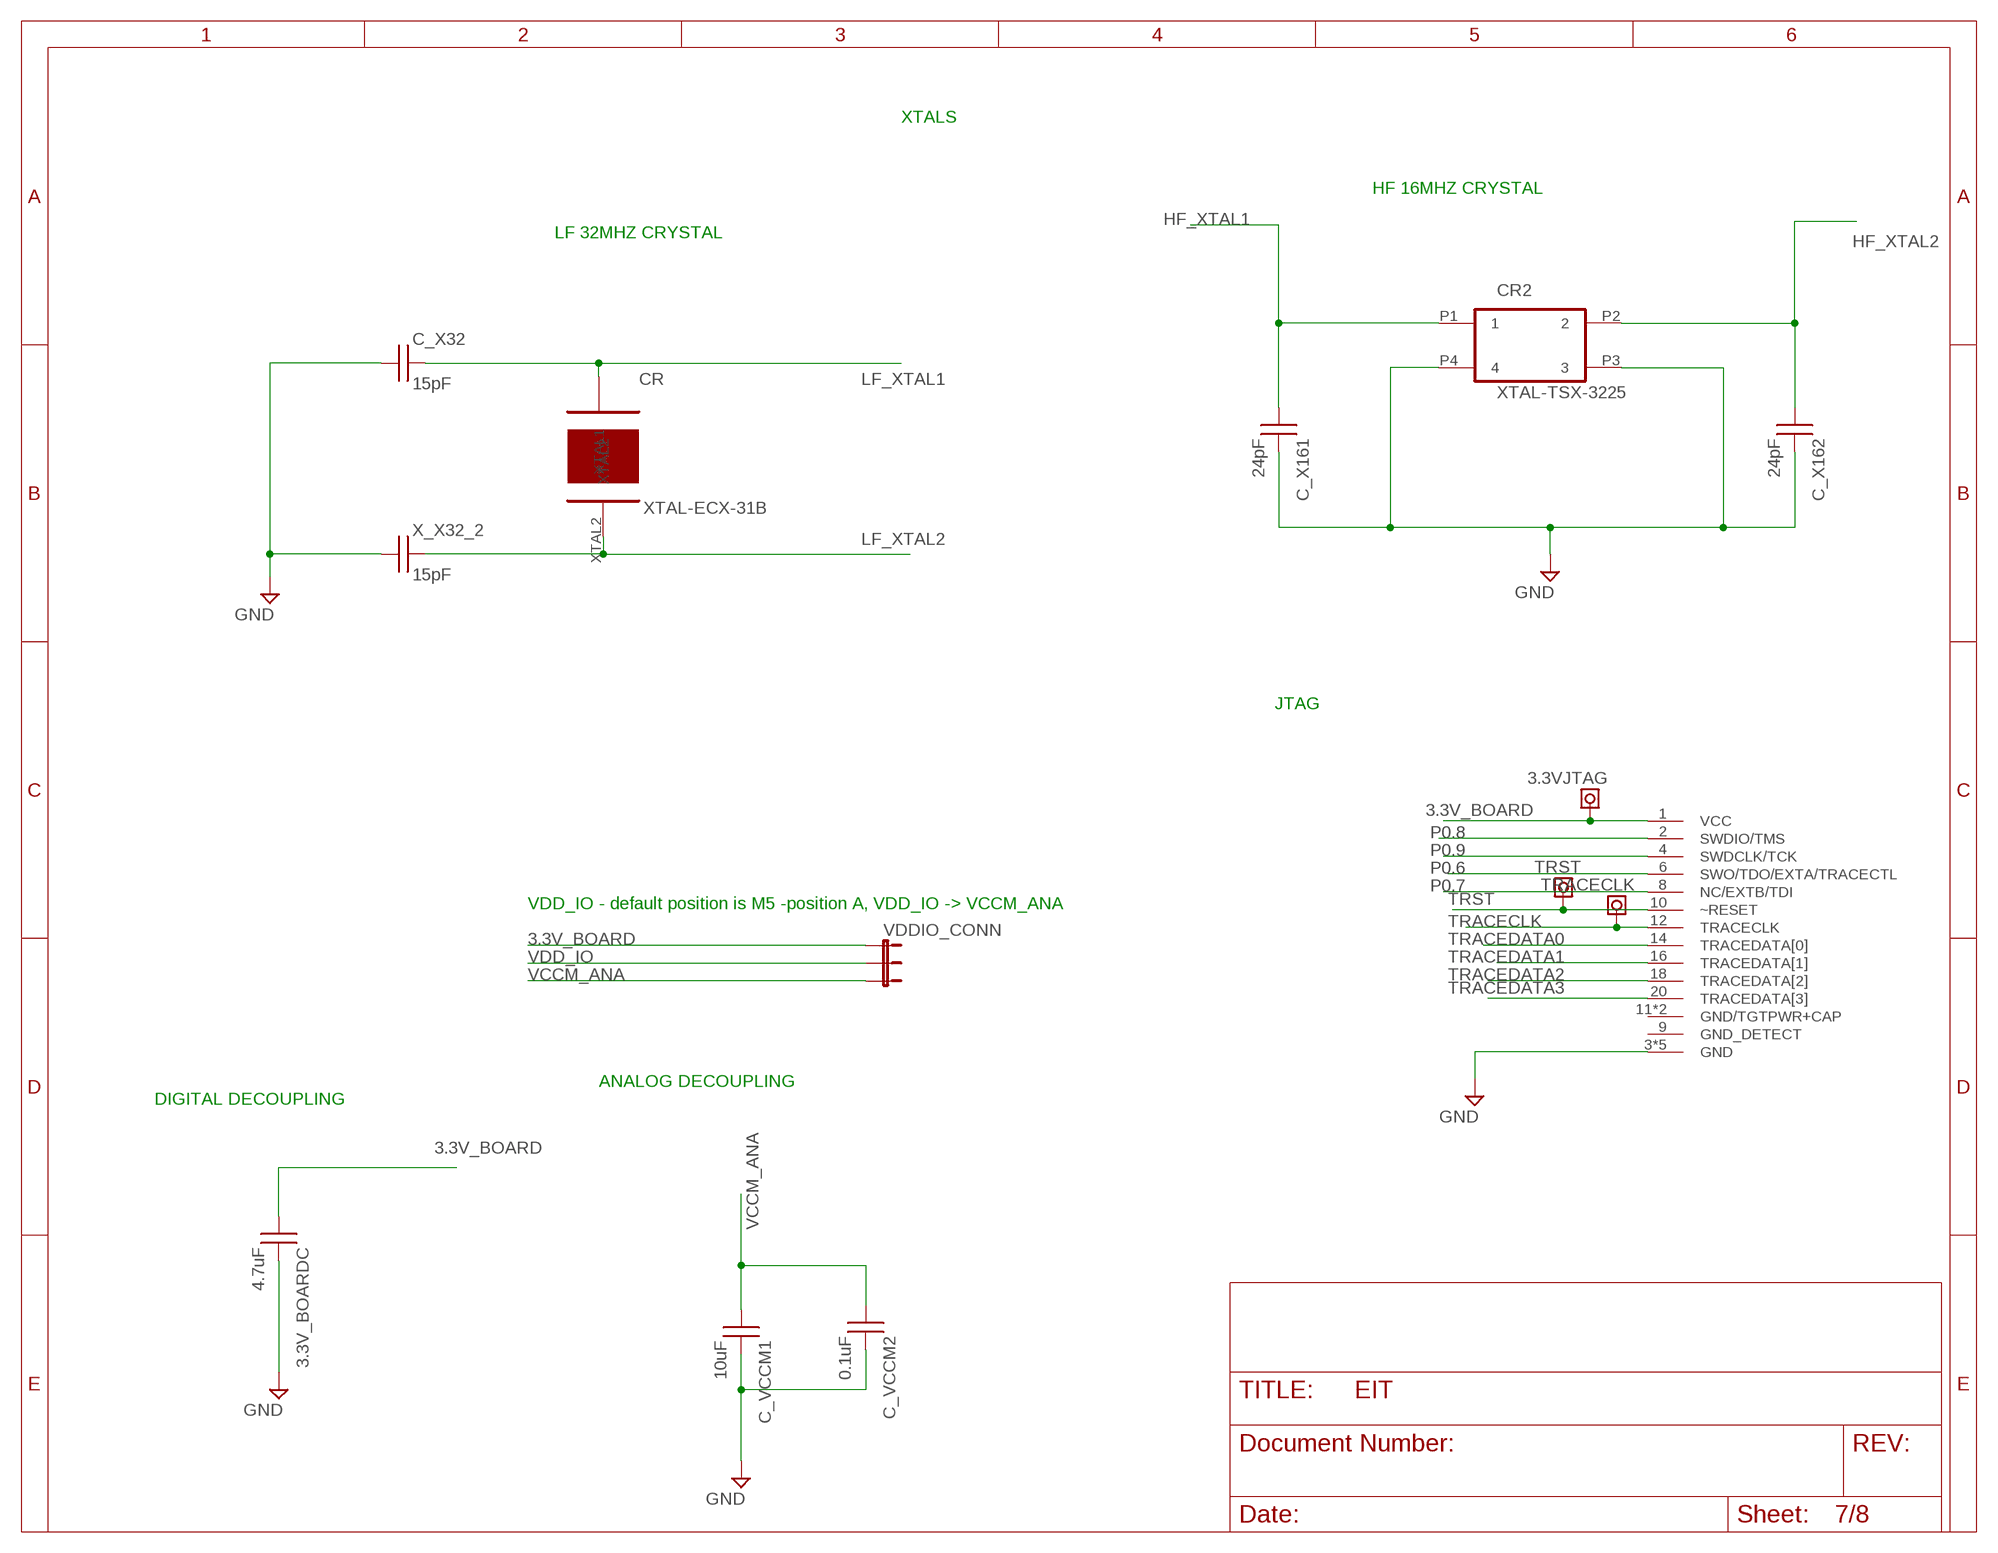
[diagram p6: schematic, sheet 7]

### Parts
3.3V_BOARDC  4.7uF  CAPACITOR-NON-POLAR-0603  [CAPC1608X87N]
3.3VJTAG  TEST_POINT-TEST_POINTMINI  [TP-MINI]
C_VCCM1  10uF  CAPACITOR-NON-POLAR-0603  [CAPC1608X87N]
C_VCCM2  0.1uF  CAPACITOR-NON-POLAR-0603  [CAPC1608X87N]
C_X32  15pF  CAPACITOR-NON-POLAR-0603  [CAPC1608X87N]
C_X161  24pF  CAPACITOR-NON-POLAR-0603  [CAPC1608X87N]
C_X162  24pF  CAPACITOR-NON-POLAR-0603  [CAPC1608X87N]
CR  XTAL-ECX-31B  [XTAL-ECX-31B]
CR2  XTAL-TSX-3225  [TSX-3225]
TRACECLK  TEST_POINT-TEST_POINTMINI  [TP-MINI]
TRST  TEST_POINT-TEST_POINTMINI  [TP-MINI]
U$11  2X10_0.05"_CORTEX_DEBUG_WITH_ETMSMD_SHROUDED  [2X10_0.05"_SMD_SH]
VDDIO_CONN  JUMPER-3PTH  [1X03]
X_X32_2  15pF  CAPACITOR-NON-POLAR-0603  [CAPC1608X87N]

### Nets
3.3V_BOARD: 3.3V_BOARDC.1 3.3VJTAG.1 U$11.1(VCC) VDDIO_CONN.1 ; also sheet 3,4,8
GND: 3.3V_BOARDC.2 C_VCCM1.2 C_VCCM2.2 C_X32.1 C_X161.2 C_X162.2 CR2.P3 CR2.P4 U$11.3(GND) U$11.5(GND) U$11.15(GND) U$11.17(GND) U$11.19(GND) X_X32_2.1 ; also sheet 1,3,4,5,6,8
HF_XTAL1: C_X161.1 CR2.P1 ; also sheet 1
HF_XTAL2: C_X162.1 CR2.P2 ; also sheet 1
LF_XTAL1: C_X32.2 CR.XTAL1 ; also sheet 1
LF_XTAL2: CR.XTAL2 X_X32_2.2 ; also sheet 1
P0.6: U$11.6(SWO/TDO/EXTA/TRACECTL) ; also sheet 2,4
P0.7: U$11.8(NC/EXTB/TDI) ; also sheet 2,4
P0.8: U$11.2(SWDIO/TMS) ; also sheet 2,4
P0.9: U$11.4(SWDCLK/TCK) ; also sheet 2,4
TRACECLK: TRACECLK.1 U$11.12(TRACECLK) ; also sheet 1
TRACEDATA0: U$11.14(TRACEDATA[0]) ; also sheet 1
TRACEDATA1: U$11.16(TRACEDATA[1]) ; also sheet 1
TRACEDATA2: U$11.18(TRACEDATA[2]) ; also sheet 1
TRACEDATA3: U$11.20(TRACEDATA[3]) ; also sheet 1
TRST: TRST.1 U$11.10(~RESET) ; also sheet 1
VCCM_ANA: C_VCCM1.1 C_VCCM2.1 VDDIO_CONN.3 ; also sheet 1,3,5,6
VDD_IO: VDDIO_CONN.2 ; also sheet 1
Unconnected: U$11.9(GND_DETECT) U$11.11(GND/TGTPWR+CAP) U$11.13(GND/TGTPWR+CAP)

### Notes on the sheet
- XTALS
- HF 16MHZ CRYSTAL
- LF 32MHZ CRYSTAL
- JTAG
- VDD_IO - default position is M5 -position A, VDD_IO -> VCCM_ANA
- ANALOG DECOUPLING
- DIGITAL DECOUPLING

## Sheet 8 of 8
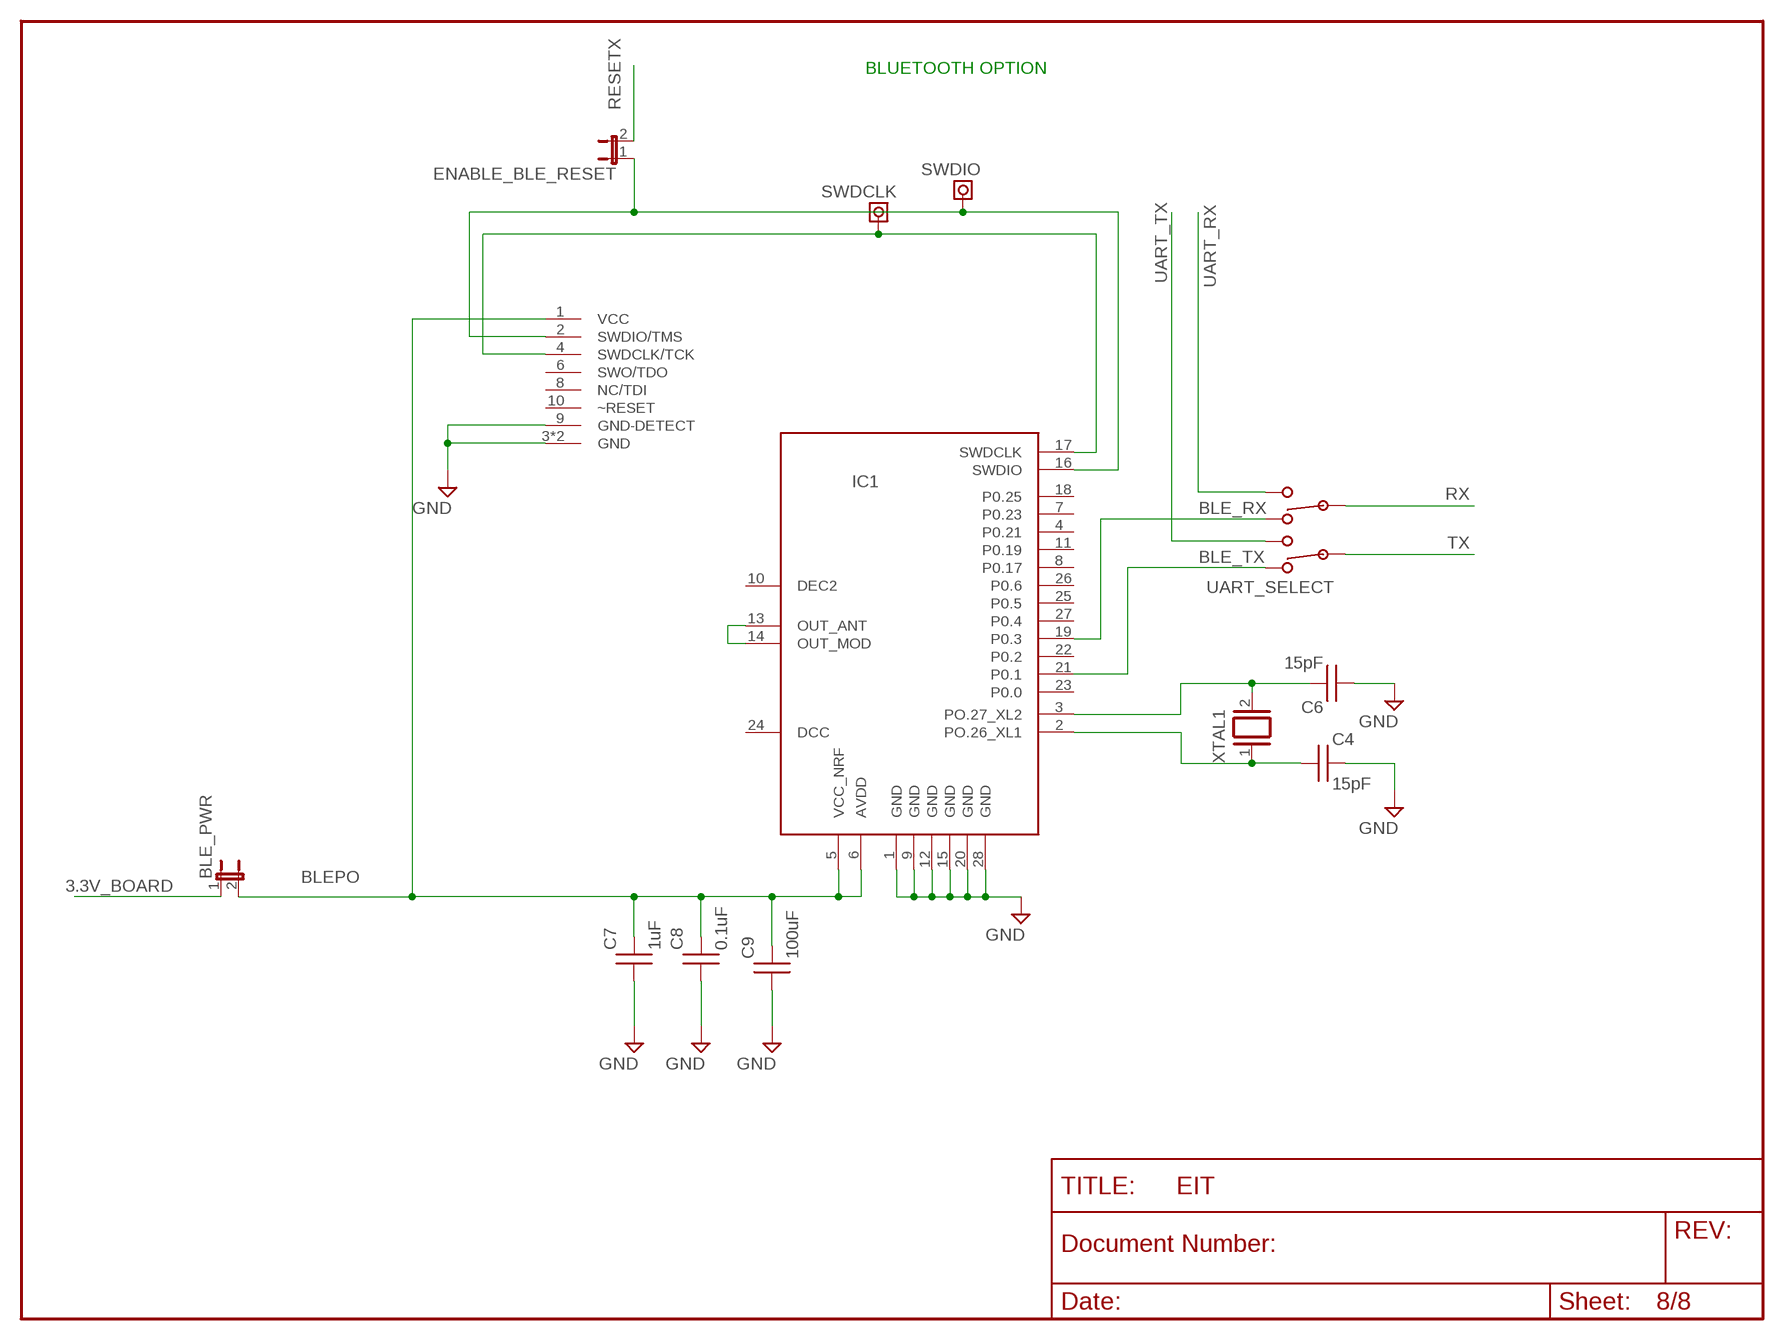
[diagram p7: schematic, sheet 8]

### Parts
BLE_PWR  JUMPER-2PTH  [1X02]
C4  15pF  CAPACITOR-NON-POLAR-0603  [CAPC1608X87N]
C6  15pF  CAPACITOR-NON-POLAR-0603  [CAPC1608X87N]
C7  1uF  CAPACITOR-NON-POLAR-0603  [CAPC1608X87N]
C8  0.1uF  CAPACITOR-NON-POLAR-0603  [CAPC1608X87N]
C9  100uF  CAPACITOR-NON-POLAR-0805  [CAP2012X100N]
ENABLE_BLE_RESET  JUMPER-2PTH  [1X02]
IC1  TY-EYSGJNAWY-1X  [TY-EYSGJN]
SWDCLK  TEST_POINT-TEST_POINTMINI  [TP-MINI]
SWDIO  TEST_POINT-TEST_POINTMINI  [TP-MINI]
U$10  2X5_0.05"_CORTEX_DEBUGSMD_SHROUDED  [2X5_0.05"_SMD_SH]
UART_SELECT  SWITCH-DPDT  [SWITCH-G13AH]
XTAL1  XTAL_BLE-2-SMD  [FC-12M]

### Nets
3.3V_BOARD: BLE_PWR.1 ; also sheet 3,4,7
BLE_RX: IC1.19(P0.3) UART_SELECT.1
BLE_TX: IC1.21(P0.1) UART_SELECT.4
BLEPO: BLE_PWR.2 C7.2 C8.2 C9.2 IC1.5(VCC_NRF) IC1.6(AVDD) U$10.1(VCC)
GND: C4.2 C6.1 C7.1 C8.1 C9.1 IC1.1(GND) IC1.9(GND) IC1.12(GND) IC1.15(GND) IC1.20(GND) IC1.28(GND) U$10.3(GND) U$10.5(GND) U$10.9(GND-DETECT) ; also sheet 1,3,4,5,6,7
N$1: IC1.13(OUT_ANT) IC1.14(OUT_MOD)
N$4: C4.1 IC1.2(PO.26_XL1) XTAL1.1
N$7: C6.2 IC1.3(PO.27_XL2) XTAL1.2
N$13: IC1.17(SWDCLK) SWDCLK.1 U$10.4(SWDCLK/TCK)
N$14: ENABLE_BLE_RESET.1 IC1.16(SWDIO) SWDIO.1 U$10.2(SWDIO/TMS)
RESETX: ENABLE_BLE_RESET.2 ; also sheet 1,4
RX: UART_SELECT.2 ; also sheet 4
TX: UART_SELECT.5 ; also sheet 4
UART_RX: UART_SELECT.3 ; also sheet 4
UART_TX: UART_SELECT.6 ; also sheet 4
Unconnected: IC1.4(P0.21) IC1.7(P0.23) IC1.8(P0.17) IC1.10(DEC2) IC1.11(P0.19) IC1.18(P0.25) IC1.22(P0.2) IC1.23(P0.0) IC1.24(DCC) IC1.25(P0.5) IC1.26(P0.6) IC1.27(P0.4) U$10.6(SWO/TDO) U$10.8(NC/TDI) U$10.10(~RESET)

### Notes on the sheet
- BLUETOOTH OPTION

## Library data of the parts
3.3V_BOARDC VREF = BiomedicalImagingLibrary:CAPACITOR-NON-POLAR; MPN: GRM188R60J475ME19D; OC_NEWARK: 40X5877
3.3V_TP DOWNLOAD_TP RESET_TP SWCLK SWIO UART_RX UART_TX VCCM_ANA = BiomedicalImagingLibrary:TEST_POINT; MPN: H2173-05; OC_NEWARK: 55K6288; PARTNO: 5003
3.3VJTAG GND SWDCLK SWDIO TRACECLK TRST = BiomedicalImagingLibrary:TEST_POINT; PARTNO: 5003
ADP3333 = BiomedicalImagingLibrary:REGULATOR-ADP3333ARMZ-3.3-R7: High Accuracy Ultralow IQ, 300 mA, anyCAP Low Dropout Regulator; MPN: ADP3333ARMZ-3.3-R7; OC_FARNELL: 2074872; OC_NEWARK: 67W2712; PACKAGE: MSOP-8; SUPPLIER: Analog Devices
AFE M1 = BiomedicalImagingLibrary:PINHD-2X4: PIN HEADER; PARTNO: 3020-08-0200-02
AVDD_TXRX DVDDC = BiomedicalImagingLibrary:CAPACITOR-NON-POLAR; MPN: MCTEA4R7M1HB-0512P; OC_NEWARK: 79R7611; PARTNO: GRM188R71E474KA12D
BATT J_RCAL POWER PWRSUPPLY USBPWR = BiomedicalImagingLibrary:JUMPER-2: Jumper Basic 0.1" spaced jumper. Use with breakaway headers.; MPN: M20-9990246; OC_NEWARK: 56K0146
BLE_PWR ENABLE_BLE_RESET = BiomedicalImagingLibrary:JUMPER-2: Jumper Basic 0.1" spaced jumper. Use with breakaway headers.; PARTNO: M20-9990246
C1 C8 = BiomedicalImagingLibrary:CAPACITOR-NON-POLAR; PARTNO: GRM188R71C104KA01D
C2 C3 = BiomedicalImagingLibrary:CAPACITOR-NON-POLAR; PARTNO: GRM188R60G106ME47D
C4 C6 = BiomedicalImagingLibrary:CAPACITOR-NON-POLAR; PARTNO: GRM1885C1H150JA01D
C5 C7 = BiomedicalImagingLibrary:CAPACITOR-NON-POLAR; PARTNO: GRM188R60J105KA01D
C9 = BiomedicalImagingLibrary:CAPACITOR-NON-POLAR; PARTNO: GRM21BR60G107ME15L
C_VCCM1 = BiomedicalImagingLibrary:CAPACITOR-NON-POLAR; MPN: C0805C106Z8VACTU; OC_NEWARK: 76Y2954; PARTNO: GRM188R60G106ME47D
C_VCCM2 VCCM_DIG = BiomedicalImagingLibrary:CAPACITOR-NON-POLAR; MPN: MC0402X104K100CT; OC_NEWARK: 06R4869; PARTNO: GRM188R71C104KA01D
C_X32 X_X32_2 = BiomedicalImagingLibrary:CAPACITOR-NON-POLAR; MPN: GRM188R60J475ME19D; OC_NEWARK: 40X5877; PARTNO: GRM1885C1H150JA01D
C_X161 C_X162 = BiomedicalImagingLibrary:CAPACITOR-NON-POLAR; MPN: MC0402X104K100CT; OC_NEWARK: 06R4869; PARTNO: GRM1885C1H240JA01D
CONN3 = BiomedicalImagingLibrary:MKDSN2; PARTNO: 1729128
CR = BiomedicalImagingLibrary:XTAL-ECX-31B; PARTNO: ECS-.327-7-34B-TR
CR2 = BiomedicalImagingLibrary:XTAL-TSX-3225; PARTNO: FA-238 16.0000MB-K3
CR2032 = BiomedicalImagingLibrary:CR2032; PARTNO: 3002TR
DOWNLOAD RESET = BiomedicalImagingLibrary:SWITCH-MOMENTARY-2: Various NO switches- pushbuttons, reed, etc; MF: OMRON COMPONENTS USA; MPN: B3S-1000; OC_NEWARK: 52F3560; PARTNO: 1825910-6; PROD_ID: SWCH-08441
DOWNLOAD_R = BiomedicalImagingLibrary:RESISTOR-US: US-style Resistor; MF: Multicomp Passives; MPN: MC00625W0402110K; OC_NEWARK: 58K4207; PARTNO: MCR03EZPFX1002
F1-F4 = BiomedicalImagingLibrary:FIDUCIAL
H1-H4 = BiomedicalImagingLibrary:MOUNT-HOLE: MOUNTING HOLE with drill center marker
IC1 = BiomedicalImagingLibrary:TY-EYSGJNAWY-1X: Digikey PN 587-4378-1-ND; PARTNO: EYSGJNAWY-1X
JP1 = BiomedicalImagingLibrary:PINHD-2X4: PIN HEADER; MPN: 27-12209; OC_NEWARK: 67Y9504; PARTNO: 61300821021
L1 = BiomedicalImagingLibrary:INDUCTOR; PARTNO: BLM18HG601SN1D
LED1 = BiomedicalImagingLibrary:LED; PARTNO: 150060YS75000
LED2 = BiomedicalImagingLibrary:LED; PARTNO: 150060GS75000
M_1 M_2 = BiomedicalImagingLibrary:MULTIPLEXER-ADG1608BRUZ; PARTNO: ADG1608BRUZ
P_R2 = BiomedicalImagingLibrary:RESISTOR-US: US-style Resistor; MF: VISHAY/DALE; MPN: CRCW0603560RFKEA; OC_NEWARK: 52K8621; PARTNO: MCR03ERTF5600
PWRLED = BiomedicalImagingLibrary:LED; MF: AGILENT TECHNOLOGIES; MPN: HSML-C191; OC_NEWARK: 40K0133; PARTNO: 150060BS75000
R1 = SparkFun-Resistors:RESISTOR: Resistor Basic schematic elements and footprints for 0603, 1206, and PTH resistors.; MPN: ERJ-3EKF1001V; OC_NEWARK: 64R5308; PARTNO: MCR03ERTJ102
R2 R3 = BiomedicalImagingLibrary:RESISTOR-US: US-style Resistor; PARTNO: MCR03EZPJ000
RESET_CAP = BiomedicalImagingLibrary:CAPACITOR-NON-POLAR; MF: KEMET; MPN: C0805C104J5RACTU; OC_NEWARK: 64K2889; PARTNO: GRM188R71C104KA01D
RESETR = BiomedicalImagingLibrary:RESISTOR-US: US-style Resistor; PARTNO: MCR03EZPFX1002
RL1 RL2 = BiomedicalImagingLibrary:RESISTOR-US: US-style Resistor; PARTNO: MCR03ERTF5600
U3 = BiomedicalImagingLibrary:ADUCM350; MPN: ADUCM350BBCZ; OC_NEWARK: 40Y6255
U$1 U$2 = BiomedicalImagingLibrary:ESDPROTECTION-DSILC6-4XX; MPN: DSILC6-4P6; OC_NEWARK: 32R8797
U$10 = BiomedicalImagingLibrary:2X5_0.05"_CORTEX_DEBUG; PARTNO: SHF-105-01-L-D-SM-LC
U$11 = BiomedicalImagingLibrary:2X10_0.05"_CORTEX_DEBUG_WITH_ETM; PARTNO: EHF-110-01-L-D-SM
UART_SELECT = BiomedicalImagingLibrary:SWITCH-DPDT; PARTNO: G22AP
VBIAS VDDIO = BiomedicalImagingLibrary:CAPACITOR-NON-POLAR; MF: Taiyo Yuden (U.S.A.), Inc.; MPN: JMK105BJ474KV-F; OC_NEWARK: 18J0969; PARTNO: GRM188R71E474KA12D
VDDIO_CONN = BiomedicalImagingLibrary:JUMPER-3; MPN: M20-9990345; OC_NEWARK: 56K0148
XTAL1 = BiomedicalImagingLibrary:XTAL_BLE; PARTNO: SER3673CT-ND

## Board
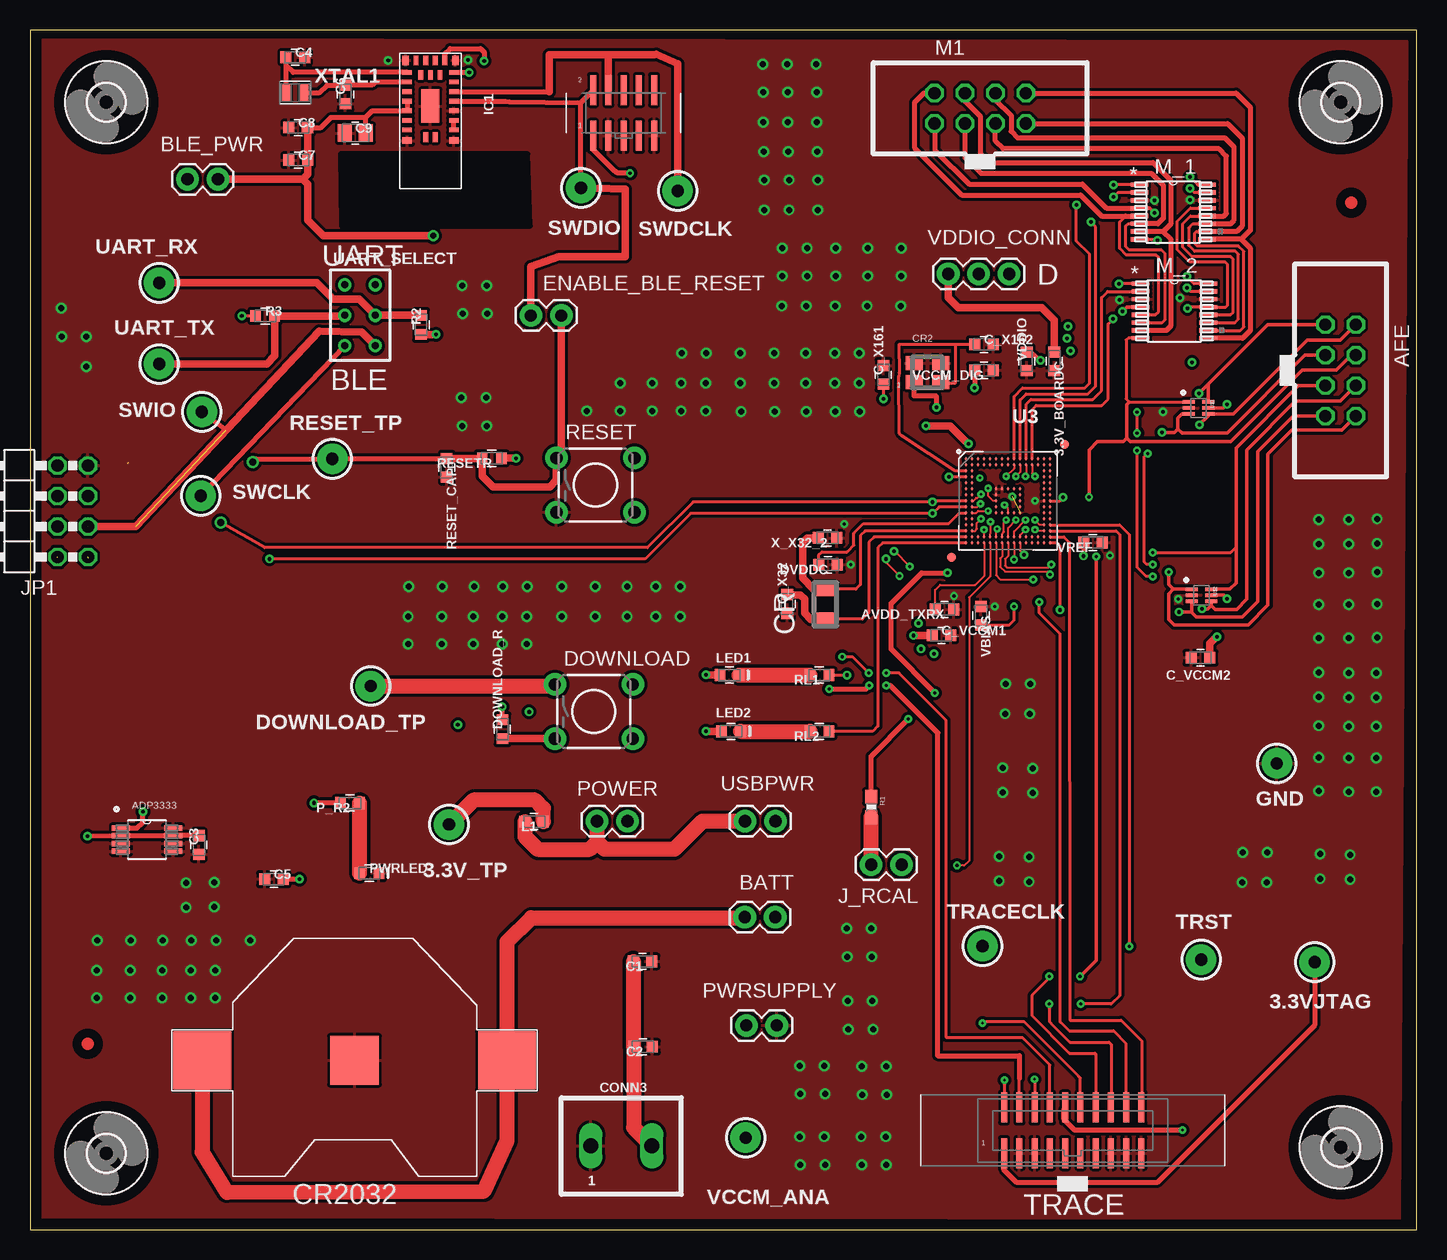
[diagram p8: board, top side]
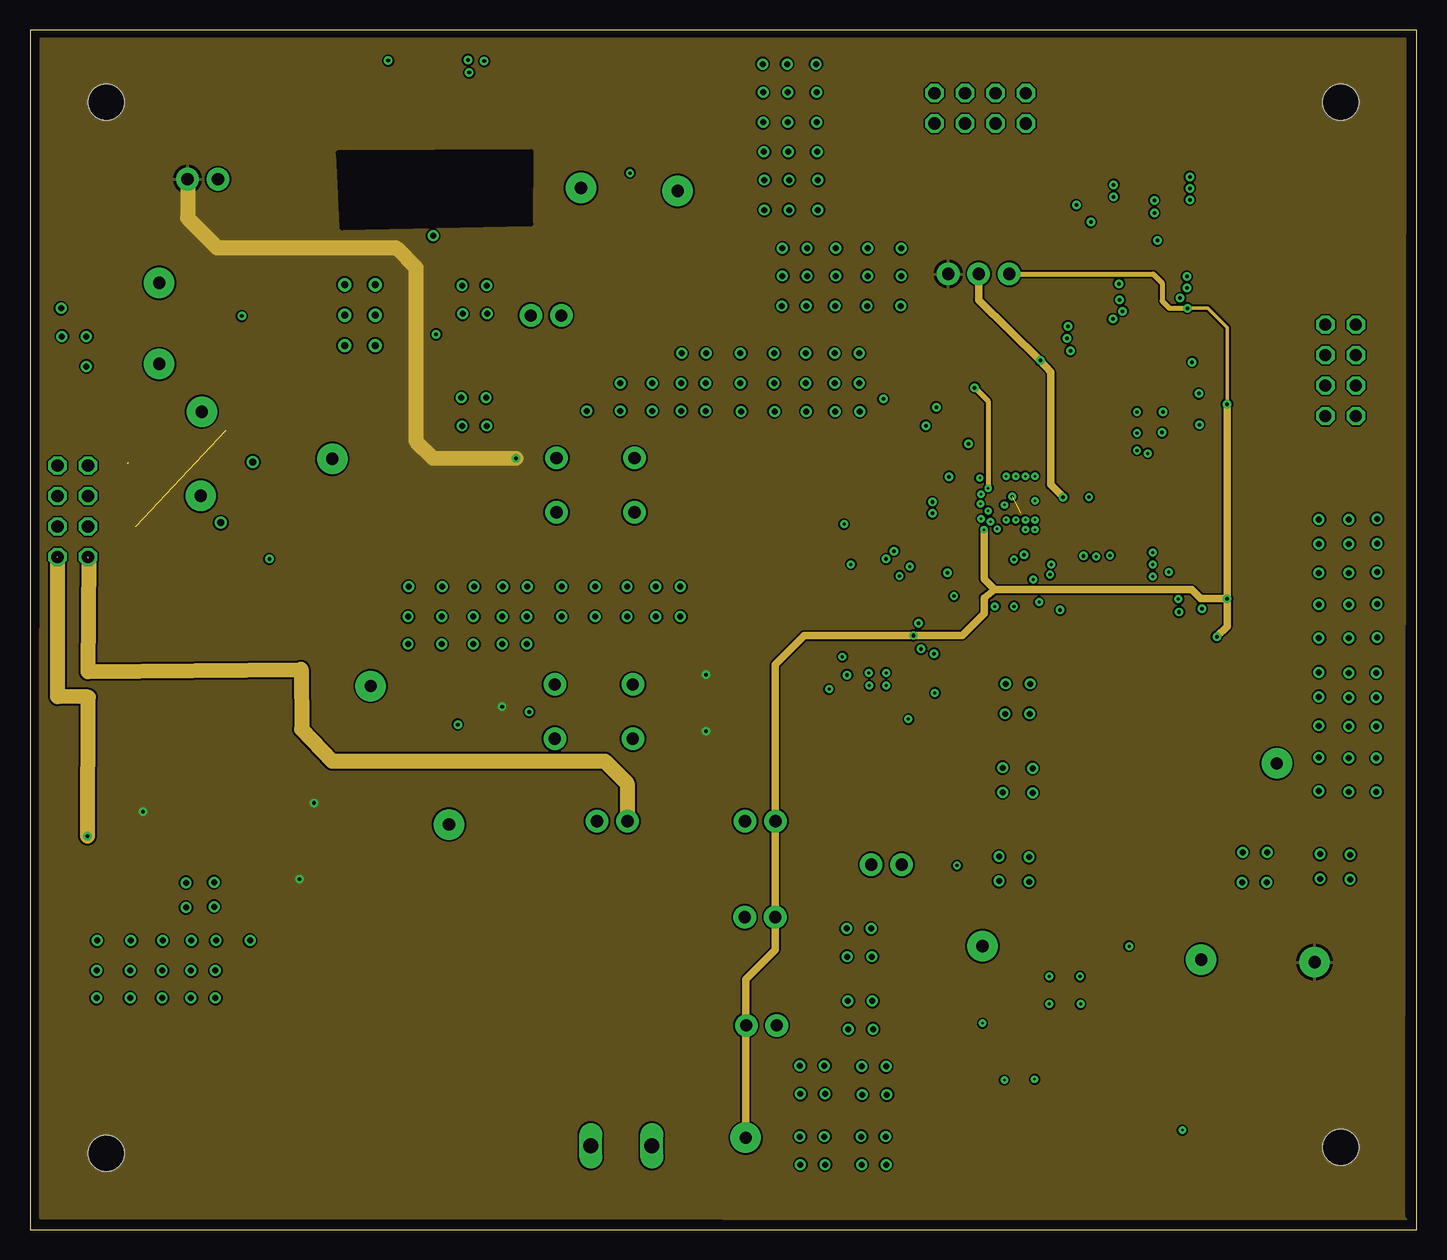
[diagram p9: board, inner layer PWR]
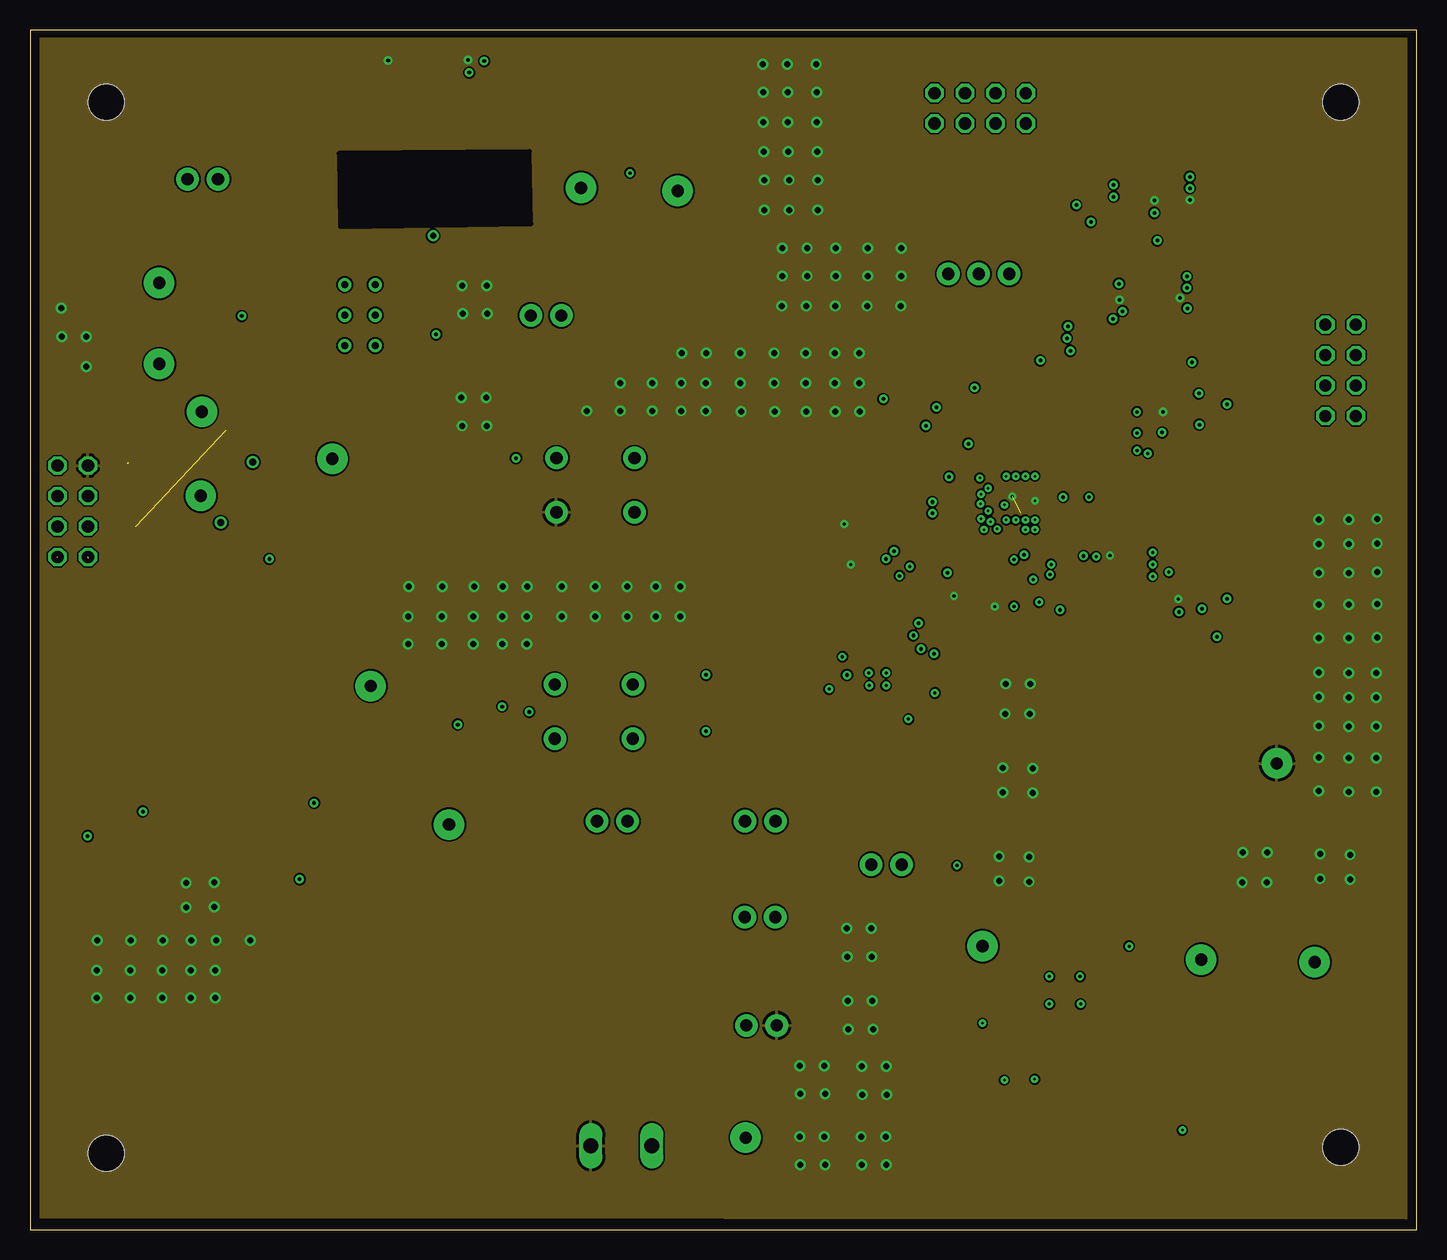
[diagram p10: board, inner layer GND]
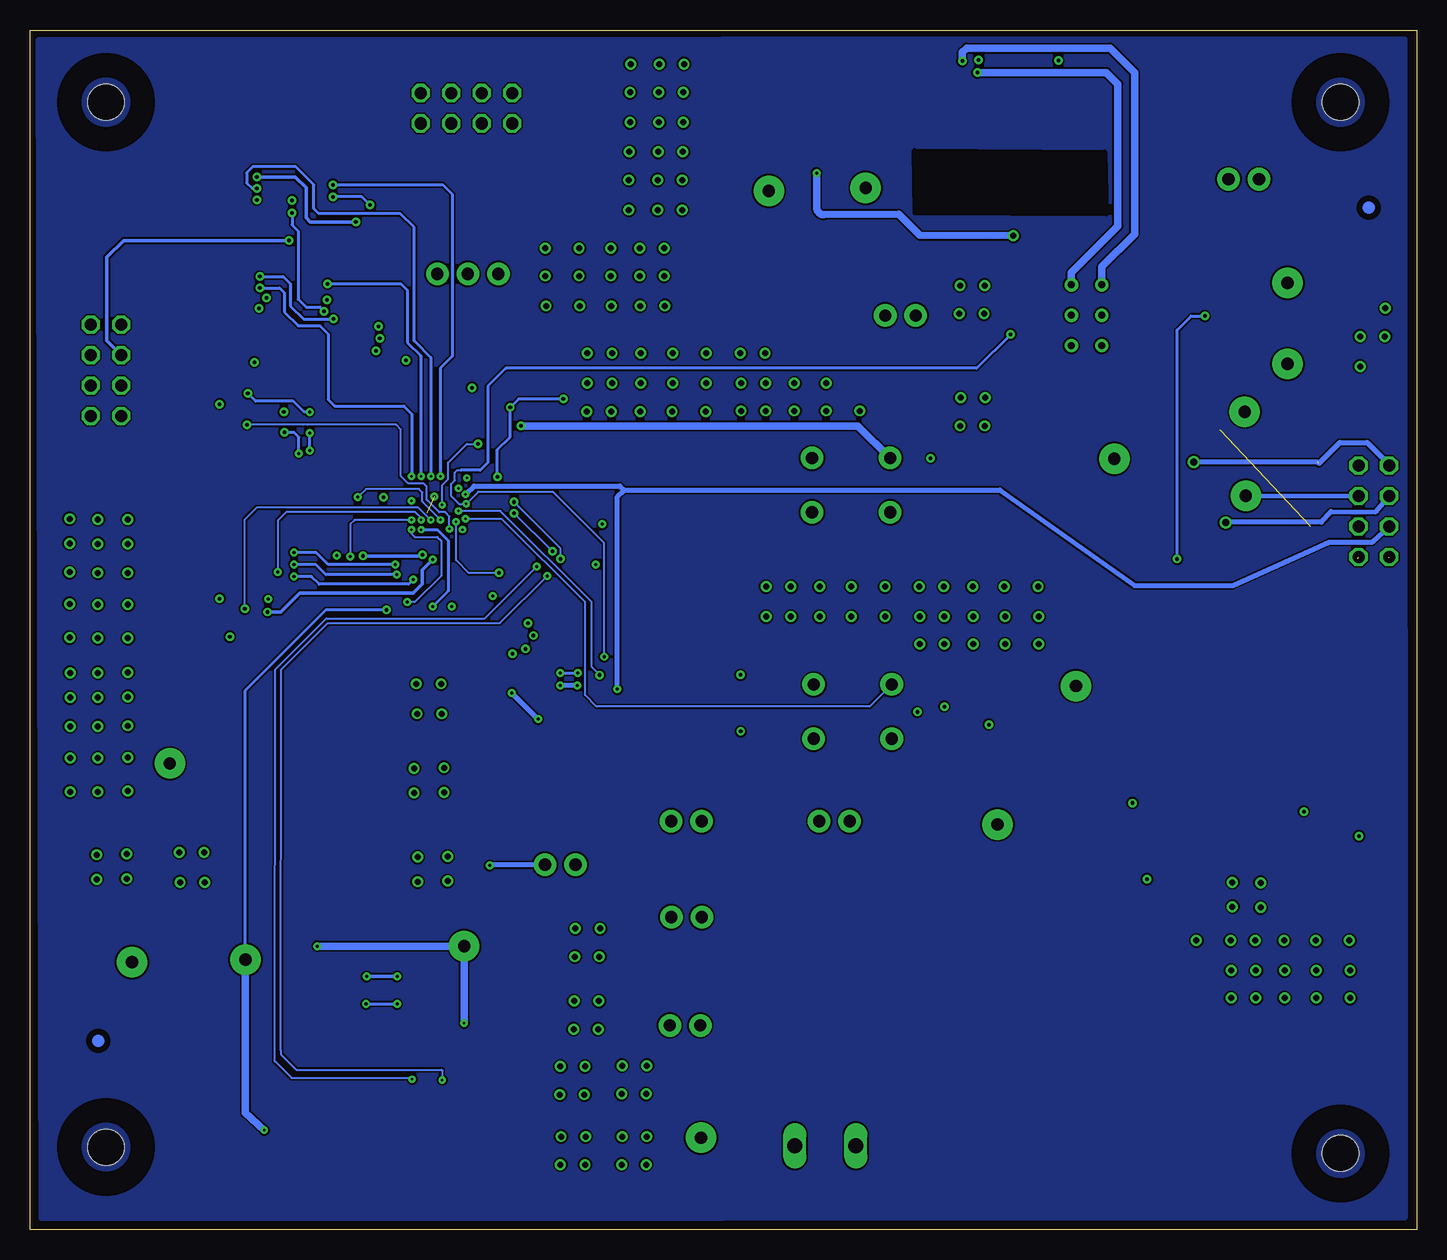
[diagram p11: board, bottom side, seen from below]

Size 115.55 x 100 mm. Coordinates in mm from the lower left corner, seen from the top.
Outline: 0,0 115.55,0 115.55,100 0,100 0,0
Copper layers (1*2*3*16): Top 0.035mm / dielectric 1.5mm / PWR 0.035mm / dielectric 1.5mm / GND 0.035mm / dielectric 1.5mm / Bottom 0.035mm
Design rules "drcsettings": minimum track width 6mil, minimum drill 6mil, track to track 6mil, track to pad 6mil, pad to pad 0mil, via to via 6mil, smd to smd 6mil, copper to edge 0mil, drill to drill 6mil, minimum pad ring 10mil, minimum via ring 8mil, stop-mask expansion 4mil, vias tented up to drill 0mil, thermal gap 10mil

### Footprints (pad centres in the part's own frame; a part is rotated, then mirrored left to right if it is on the bottom)
CAPC1608X87N = smd 0.92 x 0.97: 1 -0.775,0; 2 0.775,0
TP-MINI = drill 1.016 pad 2.54: 1 0,0
SOP65P490X110-8N = smd 1.499 x 0.432: 1 -2.184,0.965; 2 -2.184,0.33; 3 -2.184,-0.33; 4 -2.184,-0.965; 5 2.184,-0.965; 6 2.184,-0.33; 7 2.184,0.33; 8 2.184,0.965
2X04SHROUDED = drill 1.016 octagon: 1 -3.81,-1.27; 2 -3.81,1.27; 3 -1.27,-1.27; 4 -1.27,1.27; 5 1.27,-1.27; 6 1.27,1.27; 7 3.81,-1.27; 8 3.81,1.27
1X02 = drill 1.016 pad 1.88: 1 0,0; 2 2.54,0
CAP2012X100N = smd 1.16 x 1.47: 1 -0.875,0; 2 0.875,0
MKDSN2 = drill 1.27 long: 1 -2.54,0; 2 2.54,0
XTAL-ECX-31B = smd 1.1 x 1.9: XTAL1 -1.25,0; XTAL2 1.25,0
TSX-3225 = smd 1.4 x 1.15: P1 -1.1,-0.8; P2 1.1,-0.8; P3 1.1,0.8; P4 -1.1,0.8
CR2032-SMD = smd 4.826 x 4.826: +$1 -12.7,0; +$2 12.7,0 | smd 4.064 x 4.064: - 0,0
TACTILE-PTH = drill 1.016 pad 1.88: 1 -3.251,2.261; 2 3.251,2.261; 3 -3.251,-2.261; 4 3.251,-2.261
RES1608X55 = smd 0.87 x 0.98: 1 -0.8,0; 2 0.8,0
3,0 = hole 3: 0,0
TY-EYSGJN = smd 0.8 x 0.55: 1 0.6,0.475; 20 0.6,4.625 | smd 0.4 x 0.8: 2 1.6,0.6; 3 2.4,0.6; 4 3.2,0.6; 5 4,0.6; 6 4.8,0.6; 7 5.6,0.6; 8 6.4,0.6; 13 6.4,4.5; 14 5.6,4.5; 15 4.8,4.5; 16 4,4.5; 17 3.2,4.5; 18 2.4,4.5; 19 1.6,4.5 | smd 0.55 x 0.8: 9 7.275,0.6; 12 7.275,4.5 | smd 0.8 x 0.4: 10 7,2.15; 11 7,2.95; 21 0.6,3.75; 22 0.6,2.95; 23 0.6,2.15; 24 0.6,1.35; 25 1.8,3.35; 26 1.8,2.55; 27 1.8,1.75 | smd 2.8 x 1.5: 28 4.4,2.55
2X04/90 = drill 1.016 octagon: 1 -3.81,-6.35; 2 -3.81,-3.81; 3 -1.27,-6.35; 4 -1.27,-3.81; 5 1.27,-6.35; 6 1.27,-3.81; 7 3.81,-6.35; 8 3.81,-3.81
0603_LED = smd 0.87 x 0.98: A -0.8,0; C 0.8,0
RU_16 = smd 1.473 x 0.356: 1 -2.819,2.275; 2 -2.819,1.625; 3 -2.819,0.975; 4 -2.819,0.325; 5 -2.819,-0.325; 6 -2.819,-0.975; 7 -2.819,-1.625; 8 -2.819,-2.275; 9 2.819,-2.275; 10 2.819,-1.625; 11 2.819,-0.975; 12 2.819,-0.325; 13 2.819,0.325; 14 2.819,0.975; 15 2.819,1.625; 16 2.819,2.275
0603-RES = smd 1.1 x 1: 1 -0.85,0; 2 0.85,0
ADUCM350_DUNCAN = smd 0.25 x 0.25: A1 -3.5,3.5; A2 -3,3.5; A3 -2.5,3.5; A4 -2,3.5; A5 -1.5,3.5; A6 -1,3.5; A7 -0.5,3.5; A8 0,3.5; A9 0.5,3.5; A10 1,3.5; A11 1.5,3.5; A12 2,3.5; A13 2.5,3.5; A14 3,3.5; A15 3.5,3.5; B1 -3.5,3; B2 -3,3; B3 -2.5,3; B4 -2,3; B5 -1.5,3; B6 -1,3; B7 -0.5,3; B8 0,3; B9 0.5,3; B10 1,3; B11 1.5,3; B12 2,3; B13 2.5,3; B14 3,3; B15 3.5,3; C1 -3.5,2.5; C2 -3,2.5; C14 3,2.5; C15 3.5,2.5; D1 -3.5,2; D2 -3,2; D14 3,2; D15 3.5,2; E1 -3.5,1.5; E2 -3,1.5; E14 3,1.5; E15 3.5,1.5; F1 -3.5,1; F2 -3,1; F6 -1,1; F7 -0.5,1; F8 0,1; F9 0.5,1; F10 1,1; F14 3,1; F15 3.5,1; G1 -3.5,0.5; G2 -3,0.5; G6 -1,0.5; G10 1,0.5; G14 3,0.5; G15 3.5,0.5; H1 -3.5,0; H2 -3,0; H6 -1,0; H10 1,0; H14 3,0; H15 3.5,0; J1 -3.5,-0.5; J2 -3,-0.5; J6 -1,-0.5; J10 1,-0.5; J14 3,-0.5; J15 3.5,-0.5; K1 -3.5,-1; K2 -3,-1; K6 -1,-1; K7 -0.5,-1; K8 0,-1; K9 0.5,-1; K10 1,-1; K14 3,-1; K15 3.5,-1; L1 -3.5,-1.5; L2 -3,-1.5; L14 3,-1.5; L15 3.5,-1.5; M1 -3.5,-2; M2 -3,-2; M14 3,-2; M15 3.5,-2; N1 -3.5,-2.5; N2 -3,-2.5; N14 3,-2.5; N15 3.5,-2.5; P1 -3.5,-3; P2 -3,-3; P3 -2.5,-3; P4 -2,-3; P5 -1.5,-3; P6 -1,-3; P7 -0.5,-3; P8 0,-3; P9 0.5,-3; P10 1,-3; P11 1.5,-3; P12 2,-3; P13 2.5,-3; P14 3,-3; P15 3.5,-3; R1 -3.5,-3.5; R2 -3,-3.5; R3 -2.5,-3.5; R4 -2,-3.5; R5 -1.5,-3.5; R6 -1,-3.5; R7 -0.5,-3.5; R8 0,-3.5; R9 0.5,-3.5; R10 1,-3.5; R11 1.5,-3.5; R12 2,-3.5; R13 2.5,-3.5; R14 3,-3.5; R15 3.5,-3.5 | smd 0.75 x 0.75: FID1 4.71,4.71; FID2 -4.71,-4.71
SOT-666 = smd 0.3 x 0.99: 1 -0.5,-0.805; 2 0,-0.805; 3 0.5,-0.805; 4 0.5,0.805; 5 0,0.805; 6 -0.5,0.805
2X5_0.05"_SMD_SH = smd 0.5 x 2.5: 1 -2.54,-1.905; 2 -2.54,1.905; 3 -1.27,-1.905; 4 -1.27,1.905; 5 0,-1.905; 6 0,1.905; 7 1.27,-1.905; 8 1.27,1.905; 9 2.54,-1.905; 10 2.54,1.905
2X10_0.05"_SMD_SH = smd 0.5 x 2.5: 1 -5.715,-1.905; 2 -5.715,1.905; 3 -4.445,-1.905; 4 -4.445,1.905; 5 -3.175,-1.905; 6 -3.175,1.905; 7 -1.905,-1.905; 8 -1.905,1.905; 9 -0.635,-1.905; 10 -0.635,1.905; 11 0.635,-1.905; 12 0.635,1.905; 13 1.905,-1.905; 14 1.905,1.905; 15 3.175,-1.905; 16 3.175,1.905; 17 4.445,-1.905; 18 4.445,1.905; 19 5.715,-1.905; 20 5.715,1.905
SWITCH-G13AH = drill 0.6: 1 1.27,2.54; 2 1.27,0; 3 1.27,-2.54; 4 -1.27,2.54; 5 -1.27,0; 6 -1.27,-2.54
1X03 = drill 1.016 pad 1.88: 1 0,0; 2 2.54,0; 3 5.08,0
FC-12M = smd 0.7 x 1.4: 1 -0.75,0; 2 0.75,0

### Placement (x,y rotation side)
3.3V_BOARDC  85.36,72.39 270 top
3.3V_TP  34.92,33.76 0 top
3.3VJTAG  107.05,22.29 0 top
ADP3333  9.75,32.5 0 top
AFE  109.22,71.63 270 top
AVDD_TXRX  76.2,51.69 180 top
BATT  59.56,26.04 0 top
BLE_PWR  13.13,87.56 0 top
C1  51.05,22.35 180 top
C2  51.08,15.24 180 top
C3  14.07,32.06 90 top
C4  22.1,97.73 0 top
C5  20.32,29.21 0 top
C6  26.29,94.62 90 top
C7  22.36,89.16 0 top
C8  22.35,91.86 0 top
C9  27.11,91.41 0 top
C_VCCM1  75.95,49.53 0 top
C_VCCM2  97.54,47.67 180 top
C_X32  63.1,52.15 90 top
C_X161  71.12,71.25 90 top
C_X162  79.5,73.79 0 top
CONN3  49.28,6.99 0 top
CR  66.28,52.12 90 top
CR2  74.79,71.44 0 top
CR2032  27.05,14.1 180 top
DOWNLOAD  46.99,43.18 0 top
DOWNLOAD_R  39.37,41.71 90 top
DOWNLOAD_TP  28.39,45.3 180 top
DVDDC  66.5,55.42 180 top
ENABLE_BLE_RESET  41.74,76.2 0 top
F1  3.97,85.2 0 bottom
F2  4.83,15.49 0 top
F3  110.11,85.6 0 top
F4  109.86,15.75 0 bottom
GND  103.9,38.86 0 top
H1  109.22,6.86 0 top
H2  6.35,6.35 0 top
H3  109.22,93.98 0 top
H4  6.35,93.98 0 top
IC1  30.82,98.06 270 top
J_RCAL  72.64,30.41 180 top
JP1  -1.52,59.88 90 top
L1  42.01,34.01 180 top
LED1  58.29,46.23 0 top
LED2  58.42,41.53 0 top
M1  79.18,93.47 0 top
M_1  95.27,84.82 0 top
M_2  95.36,76.58 0 top
P_R2  26.67,35.56 180 top
POWER  47.24,34.04 0 top
PWRLED  28.27,29.71 0 top
PWRSUPPLY  62.23,17.02 180 top
R1  70.1,35.23 270 top
R2  32.59,75.42 90 top
R3  19.59,76.16 0 top
RESET  47.12,62.06 0 top
RESET_CAP  34.72,63.52 270 top
RESET_TP  25.19,64.25 180 top
RESETR  38.48,64.29 180 top
RL1  65.79,46.23 180 top
RL2  65.79,41.53 180 top
SWCLK  14.23,61.17 0 top
SWDCLK  53.98,86.59 0 top
SWDIO  45.91,86.83 0 top
SWIO  14.32,68.17 0 top
TRACECLK  79.38,23.62 0 top
TRST  97.59,22.5 0 top
U3  81.5,60.75 0 top
U$1  97.38,68.49 270 top
U$2  97.62,52.88 270 top
U$10  49.47,93.08 0 top
U$11  86.89,8.26 0 top
UART_RX  10.76,78.92 0 top
UART_SELECT  27.5,76.22 0 top
UART_TX  10.76,72.16 0 top
USBPWR  59.58,34.04 0 top
VBIAS  79.25,51.18 270 top
VCCM_ANA  59.64,7.66 0 top
VCCM_DIG  79.5,71.63 180 top
VDDIO  83.06,72.39 90 top
VDDIO_CONN  76.52,79.66 0 top
VREF  88.57,57.27 180 top
X_X32_2  66.46,57.65 180 top
XTAL1  22.1,94.77 0 top

### Tracks (layer width: path | path; a pad name or v marks a point on that pad's centre or on a via)
3.3V_BOARD  (via drill 0.3)
  Top 0.406: ADP3333.1 8.91,33.47 9.4,33.95 v9.4,34.85 | C5.2 v22.47,29.21 | P_R2.2 v23.68,35.56 | DOWNLOAD_R.2 39.37,43.58 v39.35,43.6 | 3.3VJTAG.1 107.05,17.04 93.92,3.91 82.24,3.91 81.16,4.99 81.16,6.32 arc-45 U$11.1
  Top 0.61: 3.3V_BOARDC.1 85.36,75.79 84.3,76.85 77.35,76.85 76.5,77.7 76.5,79.64 VDDIO_CONN.1 | RESETR.1 39.3,64.3 v40.5,64.3 | LED2.A v56.32,41.53 | LED1.A 56.35,46.23 v56.34,46.24
  PWR 1.27: BLE_PWR.1 13.13,84.32 15.6,81.85 30.5,81.85 32.15,80.2 32.15,65.75 33.6,64.3 v40.5,64.3
  pour PWR: 0.86,99.3 0.82,0.96 114.71,0.87 114.58,0.95 114.53,1.48 114.67,99.26
5V_USB  (via drill 0.3)  (1 unrouted)
  Top 0.406: C3.2 ADP3333.7 ADP3333.2 v4.8,32.79
  PWR 1.27: v4.8,32.79 4.86,44.38 2.31,44.42 2.31,56.03
A0  (via drill 0.2, 0.3)
  Top 0.152: U3.B9 82,63.45 v81.35,62.8
  Top 0.254: M_1.1 v90.3,87.1
  Bottom 0.254: v90.3,87.1 81.15,87.1 80.35,86.3 80.35,72.8 81.35,71.8 v81.35,62.8
A0_2  (via drill 0.2, 0.3)
  Top 0.152: U3.B11 83,62.85 v82.95,62.8
  Top 0.254: M_2.1 v90.75,78.85
  Bottom 0.254: v90.75,78.85 84.65,78.85 84.1,78.3 84.1,73.95 83,72.85 83,62.85 v82.95,62.8
A1  (via drill 0.3)
  Top 0.254: M_1.16 97.3,87.1 v96.65,87.75 | U3.A10 82.5,69.15 83,69.65 88.15,69.65 88.8,70.3 88.8,83.6 v88.4,84
  Bottom 0.305: v88.4,84 92.2,84 92.55,84.35 92.55,86.85 93.45,87.75 v96.65,87.75
A1_2  (via drill 0.3)
  Top 0.254: M_2.16 97,78.85 v96.4,79.45 | U3.A12 83.5,68.35 83.85,68.7 89.3,68.7 89.85,69.25 89.85,75.5 v90.25,75.9
  Bottom 0.254: v96.4,79.45 94.45,79.45 93.85,78.85 93.85,77 92.75,75.9 v90.25,75.9
A2  (via drill 0.2, 0.3)
  Top 0.152: U3.B10 82.5,63.15 v82.15,62.8
  Top 0.254: M_1.15 97,86.45 v96.65,86.8
  Bottom 0.254: v82.15,62.8 82.15,72.7 83.55,74.1 83.55,81.2 83.55,83.55 84.7,84.7 91.5,84.7 91.9,85.1 91.9,87.1 93.4,88.6 97,88.6 97.5,88.1 97.5,87.25 97.05,86.8 v96.65,86.8
A2_2  (via drill 0.2, 0.3)
  Top 0.152: U3.B12 83.5,63.05 v83.75,62.8
  Top 0.254: M_2.15 96.7,78.2 v96.4,78.5
  Bottom 0.254: v96.4,78.5 94.75,78.5 94.35,78.1 94.35,76.5 93.2,75.35 91.4,75.35 90.7,74.65 90.7,69.2 90.15,68.65 84.4,68.65 83.75,68 v83.75,62.8
AFE1  (via drill 0.25, 0.3)
  Top 0.152: U3.R6 80.5,54.55 80.85,54.2 v83.6,54.2
  Top 0.254: v93.55,54.45 93,54.45 92.25,55.2 v92.25,64.95 | v92.25,66.4 v92.25,68.15
  Top 0.305: AFE.1 103.14,75.44 98.18,70.48 | U$1.6 98.18,70.48 | v97.4,69.7 98.18,70.48
  Bottom 0.254: v83.6,54.2 84,53.8 91.45,53.8 92.1,54.45 v93.55,54.45 | v92.25,64.95 v92.25,66.4 | v92.25,68.15 92.7,68.15 93.6,69.05 96.75,69.05 v97.4,69.7
AFE2  (via drill 0.2, 0.3)
  Top 0.152: U3.P6 80.5,58.3 v80.6,58.4
  Top 0.305: AFE.2 109.2,74.15 106.45,74.15 100.29,67.99 U$1.4 | U$1.4 | U$1.4 98.18,67.83 v97.45,67.1
  Bottom 0.152: v80.6,58.4 80.6,59.45 80.95,59.8 81.45,59.8 82.5,60.85 82.5,61.95 82.75,62.2 84.05,62.2 84.65,62.8 84.65,66.7 85.05,67.1 92.4,67.1 92.8,67.1 v97.45,67.1
AFE3  (via drill 0.25, 0.3)
  Top 0.152: U3.R7 81,56.1 80.85,55.95 80.85,55.25 81.25,54.85 84.75,54.85 v85,54.6
  Top 0.254: M_1.8 93.85,82.55 v93.95,82.45 | v93.55,55.45 93.05,55.45 92.85,55.65 92.85,64.4 v93.15,64.7
  Top 0.305: AFE.3 106.25,72.9 99.75,66.4 96,66.4 95.65,66.75 | U$1.3 95.99,67.99 95.65,67.65 95.65,66.75 | v94.35,66.45 95.35,66.45 95.65,66.75
  Bottom 0.254: v85,54.6 90.9,54.6 91.75,55.45 v93.55,55.45 | v93.15,64.7 93.15,66.05 93.55,66.45 v94.35,66.45
  Bottom 0.305: v93.95,82.45 107.75,82.45 109.15,81.05 109.15,74.1 AFE.3
AFE4  (via drill 0.2, 0.25)
  Top 0.152: U3.P7 81,58 81.15,58.15 81.15,58.95 v81.35,59.15
  Top 0.254: M_2.8 91.5,74.3 91.35,74.15 91.35,69.25 91.61,68.99 U$1.1
  Top 0.305: AFE.4 110.1,72.9 108.85,71.65 106,71.65 100.05,65.7 91.7,65.7 91.4,66 | 91.61,68.99 91.4,68.77 91.4,66 | v88.25,61.05 88.25,65 88.95,65.7 91.1,65.7 91.4,66
  Bottom 0.152: v81.35,59.15 81.35,59.2 82.85,60.7 82.85,61.45 83.15,61.75 87.55,61.75 v88.25,61.05
AFE5  (via drill 0.25)
  Top 0.152: U3.R8 81.5,56.15 81.25,55.9 81.25,55.35 81.4,55.2 84.85,55.2 v85.1,55.45
  Top 0.254: v93.55,56.45 100.05,56.45 100.5,56.9
  Top 0.305: AFE.5 105.71,70.36 100.5,65.15 100.5,56.9 100.5,53.9 99.98,53.38 U$2.6
  Bottom 0.254: v85.1,55.45 90.7,55.45 91.7,56.45 v93.55,56.45
AFE6  (via drill 0.2, 0.3)
  Top 0.152: U3.P8 81.5,58.5 v82.15,59.15
  Top 0.305: AFE.6 109.18,69.05 105.45,69.05 101.4,65 101.4,52.55 100.55,51.7 98.75,51.7 98.43,52.02 | U$2.4 98.43,52.02 | 98.43,52.02 98.16,51.75 v97.65,51.75
  Bottom 0.152: v97.65,51.75 97.65,59.2 96.65,60.2 84.1,60.2 83.2,60.2 v82.15,59.15
AFE7  (via drill 0.25, 0.3)
  Top 0.152: U3.R9 v82,55.85
  Top 0.305: AFE.7 105.27,67.82 102.3,64.85 102.3,52.35 101,51.05 97.2,51.05 96.85,51.4 96.82,51.43 | U$2.3 96.82,51.43 | v95.75,51.48 96.77,51.48 96.82,51.43
  Bottom 0.305: v82,55.85 82.85,55 82.85,53.8 83.6,53.05 93.09,53.05 94.66,51.48 v95.75,51.48
AFE8  (via drill 0.2, 0.25)
  Top 0.152: U3.P9 82,58.2 v82.95,59.15
  Top 0.305: AFE.8 109.32,66.65 105.15,66.65 103.15,64.65 103.15,52.05 101.5,50.4 95.35,50.4 94.9,50.85 94.9,53 95.28,53.38 | 95.28,53.38 U$2.1 | 95.28,53.38 94.9,53.76 v94.9,54.8
  Bottom 0.152: v82.95,59.15 82.95,59.3 83.45,59.8 94.2,59.8 94.9,59.1 v94.9,54.8
AVDD_TX/RX
  Top 0.152: U3.R4 79.5,54.5 78.75,53.75 75.85,53.75 75.43,53.33 AVDD_TXRX.2
BLE_RX  (via drill 0.3)
  Top 0.406: IC1.19 v36.59,96.46 v36.6,96.45
  Bottom 0.61: UART_SELECT.1 28.77,79.78 24.9,83.65 24.9,95.5 25.85,96.45 v36.6,96.45
BLE_TX  (via drill 0.3)
  Top 0.406: IC1.21 34.57,98.02 35,98.45 37.55,98.45 37.85,98.15 v37.85,97.4
  Bottom 0.61: UART_SELECT.4 26.23,80.27 23.5,83 23.5,96.45 25.55,98.5 37.5,98.5 37.85,98.15 v37.85,97.4
BLEPO  (via drill 0.25, 0.5)
  Top 0.406: IC1.5 IC1.6 28.52,93.26 27.99,92.73 | C9.2 27.99,92.73 | C8.2 24.24,91.86 25.09,92.71 27.97,92.71 27.99,92.73 | C7.2 | v50,88.07 49.15,88.07 arc-45 48.72,88.25 46.92,90.04 46.92,91.15 arc-45 U$10.1
  Top 0.61: C8.2 C7.2 | BLE_PWR.2 22.73,87.56 | 22.73,87.56 23.14,87.97 C7.2 | v33.6,82.85 24.45,82.85 23.15,84.15 23.15,87.14 22.73,87.56
  Bottom 0.61: v33.6,82.85 41.4,82.89 43.15,84.64 49.39,84.6 arc90 50,85.21 v50,88.07
EN  (via drill 0.3)
  Top 0.254: M_1.2 90.65,86.45 v90.3,86.1 | U3.A9 82,69.45 82.7,70.15 87.9,70.15 88.3,70.55 88.3,81.3 87.2,82.4 v87.2,85.4
  Bottom 0.254: v90.3,86.1 87.9,86.1 v87.2,85.4
EN_2
  Top 0.254: U3.A11 83,68.8 83.4,69.2 88.55,69.2 89.3,69.95 89.3,77.7 89.8,78.2 M_2.2
GND  (via drill 0.2, 0.25, 0.3, 0.5)  (1 unrouted)
  other vias: 83.75,60.75 93.7,85.8 96.65,85.85 90.8,77.5 95.85,77.65 94.4,68.15 81.85,61.1 77,52.8 80.4,51.95 90,56.2 29.85,97.45 36.5,97.5 95.7,52.55 67.85,58.8 68.4,55.45 5.6,24.1 8.4,24.1 11.05,24.1 13.45,24.1 15.5,24.1 5.55,21.6 8.35,21.6 11,21.6 13.4,21.6 15.45,21.6 5.55,19.3 8.35,19.3 11,19.3 13.4,19.3 15.45,19.3 18.35,24.1 31.55,53.6 34.35,53.6 37,53.6 39.4,53.6 41.45,53.6 31.5,51.1 34.3,51.1 36.95,51.1 39.35,51.1 41.4,51.1 31.5,48.8 34.3,48.8 36.95,48.8 39.35,48.8 41.4,48.8 44.3,53.6 47.1,53.6 49.75,53.6 52.15,53.6 54.2,53.6 44.3,51.1 47.1,51.1 49.75,51.1 52.15,51.1 54.2,51.1 72.55,77 69.75,77 67.1,77 64.7,77 62.65,77 72.6,79.5 69.8,79.5 67.15,79.5 64.75,79.5 62.7,79.5 72.6,81.8 69.8,81.8 67.15,81.8 64.75,81.8 62.7,81.8 54.3,73.05 56.35,73.05 49.2,70.55 51.85,70.55 54.25,70.55 56.3,70.55 46.4,68.25 49.2,68.25 51.85,68.25 54.25,68.25 56.3,68.25 59.2,73.05 62,73.05 64.65,73.05 67.05,73.05 69.1,73.05 59.2,70.55 62,70.55 64.65,70.55 67.05,70.55 69.1,70.55 59.25,68.2 62.05,68.2 64.7,68.2 67.1,68.2 69.15,68.2 107.4,36.55 107.4,39.35 107.4,42 107.4,44.4 107.4,46.45 109.9,36.5 109.9,39.3 109.9,41.95 109.9,44.35 109.9,46.4 112.2,36.5 112.2,39.3 112.2,41.95 112.2,44.35 112.2,46.4 107.4,49.3 107.4,52.1 107.4,54.75 107.4,57.15 107.4,59.2 109.9,49.3 109.9,52.1 109.9,54.75 109.9,57.15 109.9,59.2 112.25,49.35 112.25,52.15 112.25,54.8 112.25,57.2 112.25,59.25 65.55,92.3 63.15,92.3 61.1,92.3 65.55,94.8 63.15,94.8 61.1,94.8 65.5,97.15 63.1,97.15 61.05,97.15 65.65,85 63.25,85 61.2,85 65.65,87.5 63.25,87.5 61.2,87.5 65.6,89.85 63.2,89.85 61.15,89.85 4.7,71.95 4.7,74.45 2.65,74.45 2.6,76.8 38.05,67 36,67 38,69.35 35.95,69.35 38.1,76.35 36.05,76.35 38.05,78.7 36,78.7 15.35,28.95 15.35,26.9 13,28.9 13,26.85 70.15,22.75 68.1,22.75 70.1,25.1 68.05,25.1 70.25,16.7 68.2,16.7 70.2,19.05 68.15,19.05 66.25,11.3 64.2,11.3 66.2,13.65 64.15,13.65 71.4,11.25 69.35,11.25 71.35,13.6 69.3,13.6 66.25,5.4 64.2,5.4 66.2,7.75 64.15,7.75 71.35,5.4 69.3,5.4 71.3,7.75 69.25,7.75 103.05,28.95 101,28.95 103.1,31.45 101.05,31.45 107.5,29.25 107.5,31.3 110,29.2 110,31.25 80.75,29.05 80.75,31.1 83.25,29 83.25,31.05 81.05,36.45 81.05,38.5 83.55,36.4 83.55,38.45 83.3,43 81.25,43 83.35,45.5 81.3,45.5
  pour GND: 114.67,99.31 114.68,0.89 0.9,0.96 0.89,99.31
  pour Top (isolate 0.254): 114.8,99.06 1.03,99.21 1.02,1.02 114.17,0.89
HF_XTAL1  (via drill 0.3)
  Top 0.254: U3.D1 v76.6,62.75 | C_X161.1 v71.12,69.25 v71.11,69.24
  Top 0.406: v75.53,68.54 75.51,69.48 73.69,69.48 CR2.P1
  Bottom 0.254: v76.6,62.75 76.6,65.02 75.54,66.08 v75.54,68.53 v75.53,68.54 74.83,69.24 v71.11,69.24
HF_XTAL2
  Top 0.254: U3.C1 77.11,63.25 72.68,66.14 72.45,66.36 72.41,71.14 72.42,71.41 72.41,73.77 72.64,73.79 77.13,73.79 | C_X162.1 77.13,73.79 | CR2.P2 75.76,70.57 77.13,70.57 77.13,73.79
KERNEL_GPIO  (via drill 0.2)
  Top 0.152: U3.N2 78.75,58.25 78.9,58.4 78.9,58.9 v79.25,59.25
  Top 1.27: DOWNLOAD_TP.1 43.6,45.3 DOWNLOAD.1
  Bottom 0.152: DOWNLOAD.1 45.58,43.6 68.35,43.6 69.3,44.55 69.3,52.3 76.25,59.25 v79.25,59.25
LF_XTAL1
  Top 0.254: U3.P1 70.35,57.75 69.9,57.3 69.9,51.42 69.36,50.88 66.29,50.88 CR.XTAL1
  Top 0.61: CR.XTAL1 65.08,50.87 64.55,51.4 64.55,52.55 64.2,52.9 63.13,52.9 C_X32.2
LF_XTAL2
  Top 0.254: U3.N1 69.6,58.25 69.2,57.85 69.2,53.76 68.82,53.38 66.29,53.38 CR.XTAL2
  Top 0.61: X_X32_2.2 64.75,57.65 64.4,57.3 64.4,54.3 65.33,53.37 CR.XTAL2
M2_1  (via drill 0.3)
  Top 0.305: M_2.4 91.4,76.9 v91.05,76.55 | M_1.4 93.3,85.15 v93.7,84.75
  Top 0.406: M1.1 75.4,92.17 75.4,90 78.25,87.15 87.7,87.15 89.7,85.15 M_1.4
  Bottom 0.254: v93.7,84.75 93.7,83.75 93.2,83.25 93.2,77.56 M_2.4 91.4,76.9 v91.05,76.55
M2_2
  Top 0.254: M_2.5 93.8,76.25 94.05,76.5 94.05,81.05 93.85,81.25 91.35,81.25 90.8,81.8 90.8,84 91.3,84.5
  Top 0.406: M1.2 74.49,94.74 73.7,93.95 73.7,90.2 77.65,86.25 87.55,86.25 89.3,84.5 91.3,84.5 M_1.5
M2_3
  Top 0.254: M_2.6 94.35,75.6 94.55,75.8 94.55,81.4 94.25,81.7 91.55,81.7 91.3,81.95 91.3,83.65 91.5,83.85 M_1.6
  Top 0.406: M1.3 77.91,89.39 79.25,88.05 93.45,88.05 94.45,87.05 94.45,84.3 94,83.85 M_1.6
M2_4
  Top 0.406: M1.4 77.91,94.09 79.2,92.8 79.2,89.7 79.95,88.95 93.6,88.95 95.05,87.5 95.05,83.8 94.45,83.2 | 94.45,83.2 M_1.7 | 94.45,83.2 95.05,82.6 95.05,75.3 94.7,74.95 M_2.7
M2_7
  Top 0.254: M_2.10 100.85,74.95 101.15,75.25 101.15,81.55 100.7,82 97.25,82 97.05,82.2 97.05,83.05 97.2,83.2 M_1.10
  Top 0.406: M1.7 99.8,92.2 101,91 101,83.65 100.55,83.2 M_1.10
M2_8
  Top 0.406: M1.8 100.51,94.74 101.7,93.55 101.7,83.3 100.95,82.55 | 100.95,82.55 M_1.9 | 100.95,82.55 101.7,81.8 101.7,74.95 101.05,74.3 M_2.9
N$1
  Top 0.406: IC1.13 IC1.14
N$3
  Top 0.61: DOWNLOAD.3 DOWNLOAD_R.1
N$4
  Top 0.406: C4.1 21.33,97.05 | 21.33,97.05 21.33,94.8 XTAL1.1 | IC1.2 21.92,96.46 21.33,97.05
N$5
  Top 1.27: PWRLED.A P_R2.1
N$6
  Top 0.254: M_2.12 100.05,76.25 100.25,76.45 100.25,80.9 100.05,81.1 96.85,81.1 96.05,81.9 96.05,83.85 96.7,84.5 M_1.12
  Top 0.406: M_1.12 99.5,84.5 99.7,84.7 99.7,89.5 99.1,90.1 81.1,90.1 80.45,90.75 M1.5
N$7
  Top 0.406: XTAL1.2 24.12,94.77 24.75,95.4 C6.2 28.5,95.4 28.76,95.66 IC1.3
N$8
  Top 1.27: LED2.C RL2.2
N$9
  Top 1.27: L1.1 42.78,35.12 42.1,35.8 36.96,35.8 3.3V_TP.1
N$10
  Top 1.27: USBPWR.1 56.04,34.04 53.7,31.7 47.89,31.7 47.26,32.33 | 47.26,32.33 47.26,34.02 POWER.1 | L1.2 41.23,32.77 42.3,31.7 46.63,31.7 47.26,32.33
N$11
  Top 1.27: LED1.C RL1.2
N$12
  Top 1.27: CR2032.+$2 14.35,6.45 16.4,3.1 37.85,3.2 39.75,7.4 CR2032.+$1 39.75,24 41.75,26 59.53,26 BATT.1
N$13
  Top 0.406: IC1.17 43.25,94.86 | 52.01,97.92 arc45 52.2,98 | 48.2,97.64 arc45 48.09,97.92
  Top 0.61: SWDCLK.1 53.98,97.17 52.2,98 | 43.25,94.86 43.25,97.92 48.09,97.92 52.01,97.92 | U$10.4 48.2,97.64
N$14
  Top 0.406: IC1.16 39.64,94.06 39.96,94.02 45.91,93.92 | SWDIO.1 45.91,93.92 | 45.91,93.92 arc-45 45.93,93.98 U$10.2
  Top 0.61: ENABLE_BLE_RESET.1 41.74,80.29 44.05,81.1 49.6,81.1 49.6,86.75 SWDIO.1
N$17
  Top 1.27: J_RCAL.2 R1.2
N$18
  cutout Top: 41.48,89.68 25.86,89.68 25.95,83.66 41.7,83.66
  cutout GND: 41.62,89.86 25.77,89.72 25.86,83.61 41.75,83.84
  cutout PWR: 41.75,89.86 25.68,89.77 25.99,83.52 41.75,83.84
  cutout Bottom: 41.84,89.95 25.99,89.81 25.86,84.65 41.79,84.74
N$21  (via drill 0.3)
  other vias: 35.65,42.1
N$22  (via drill 0.2)
  other vias: 79.15,62.65
N$23  (via drill 0.3)
  other vias: 41.6,43.15
N$29
  Top 0.254: M_2.11 100.4,75.6 100.7,75.9 100.7,81.3 100.45,81.55 97.05,81.55 96.55,82.05 96.55,83.5 96.9,83.85 M_1.11
  Top 0.406: M_1.11 100.05,83.85 100.35,84.15 100.35,90.25 99.6,91 82.3,91 81.75,91.55 81.75,92.9 80.45,94.2 M1.6
N$32
  Top 1.27: C1.2 50.28,15.27 C2.2 50.31,8.49 CONN3.2
N$38  (via drill 0.3)
  other vias: 86.7,73.25
N$39  (via drill 0.3)
  other vias: 86.5,75.3
N$40  (via drill 0.3)
  other vias: 86.4,74.3
N$48  (via drill 0.3)
  other vias: 75.35,48
N$49  (via drill 0.3)
  other vias: 74.25,48.4
N$51  (via drill 0.3)
  other vias: 74.05,50.55
N$56  (via drill 0.3)
  other vias: 96.85,72.3
N$57
  pour Bottom: 0.95,0.95 114.6,0.87 114.86,99.22 1,99.31
P0.6  (via drill 0.2, 0.25, 0.3)
  Top 0.152: v73.33,55.27 72.05,56.55 v72,56.55 | U$11.6
  Top 0.254: v19.95,55.9 51.25,55.9 55.05,59.7 v75.2,59.7 75.75,60.25 U3.J1 | R3.1 v17.66,76.16 v17.65,76.15 | v83.71,12.52 U$11.6
  Bottom 0.152: v73.33,55.27 77.65,50.95 90.85,50.95 95.1,46.7 95.14,14.01 95.12,14.01 93.74,12.63 83.82,12.63 v83.71,12.52 | v75.2,59.7 72.05,56.55 v72,56.55
  Bottom 0.254: v19.95,55.9 19.95,75 R3.1 v17.66,76.16 v17.65,76.15
P0.7  (via drill 0.2, 0.25, 0.3)
  Top 0.152: U3.J2 78.95,60.25 v79.2,60.5 | 76.39,15.99 76.35,16.04
  Top 0.254: 76.35,16.04 76.35,42.45 72.4,46.4 v71.35,46.4 | v69.9,46.4 68.55,47.75 v67.7,47.75 | U$11.8 84.99,13.71 82.71,15.99 76.39,15.99
  Top 0.61: R2.1 v33.84,74.62
  Bottom 0.152: 79.65,63.3 79.95,63.3 80.15,63.1 80.15,62.45 80.45,62.15 80.45,61.15 79.8,60.5 v79.2,60.5 78.2,61.5 71.95,61.5 67.7,57.25 v67.7,47.75
  Bottom 0.254: v33.84,74.62 36.66,71.8 75.9,71.8 77.4,70.3 77.4,63.95 78.05,63.3 79.65,63.3 | v71.35,46.4 v69.9,46.4
P0.8  (via drill 0.2, 0.25, 0.3, 0.6)
  Top 0.152: v72.46,54.49 71.35,55.6 v71.35,55.9 | U$11.2
  Top 0.254: v15.9,58.93 19.56,56.84 51.45,56.85 55.25,60.65 v75.2,60.65 75.3,60.75 U3.H1 | v81.2,12.46 U$11.2
  Bottom 0.152: v72.46,54.49 76.4,50.55 90.75,50.55 94.6,46.7 94.65,14.95 94.65,14.61 93.36,13.32 81.27,13.32 81.2,13.29 81.21,13.31 v81.2,12.46 | v75.2,60.65 71.35,56.8 v71.35,55.9
  Bottom 0.406: JP1.6 3.42,59.81 7.12,59.86 7.93,58.96 15.9,58.96 v15.9,58.93
P0.9  (via drill 0.2, 0.25)
  Top 0.152: U3.H2 78.59,60.75 78.84,61 78.95,61 v79.25,61.3
  Top 0.254: U$11.4 82.45,12.6
  Top 0.406: v71.35,45.35 71.7,45.35 75.65,41.4 75.63,14.49 82.45,14.49 82.45,12.6 | v66.6,45.05 69.65,45.05 v69.95,45.35
  Bottom 0.406: 66.05,61.65 34.72,61.65 23.5,53.67 15.31,53.67 7.27,57.3 3.71,57.3 JP1.4 | v69.95,45.35 v71.35,45.35 | v66.6,45.05 66.6,61.1 66.05,61.65 | v79.25,61.3 78.55,62 66.4,62 66.05,61.65
P0.11  (via drill 0.2, 0.3)
  Top 0.152: U3.K2 78.85,59.75 79,59.9 v79.85,59.9
  Top 0.254: RL1.1 v68.08,46.23
  Bottom 0.152: v68.08,46.23 68.75,46.9 68.75,52.3 76.35,59.9 v79.85,59.9
P4.2
  Top 0.254: U3.R1 71.05,57.25 70.65,56.85 70.65,41.96 70.22,41.53 RL2.1
RCAL1  (via drill 0.2, 0.25, 0.3)
  Top 0.152: U3.P5 80,58 80.05,58.05 v80.05,59
  Top 0.406: R1.1 70.1,39.45 v73.2,42.55 | v75.4,44.73 71.75,48.38 71.75,52.2 74.3,54.75 v76.45,54.75
  Bottom 0.152: v76.45,54.75 79,54.75 80.05,55.8 v80.05,59
  Bottom 0.406: v73.2,42.55 73.22,42.55 v75.4,44.73
RCAL2  (via drill 0.25)
  Top 0.152: U3.R5 80,54.45 78.25,52.7 78.25,30.75 77.85,30.35 v77.25,30.35
  Bottom 0.406: J_RCAL.1 77.19,30.41 v77.25,30.35
RESETX  (via drill 0.2, 0.3, 0.6)  (1 unrouted)
  Top 0.152: U3.K8 81.5,60.1 v81.2,60.4
  Top 0.406: RESET_CAP.1 34.68,64.25 RESET_TP.1 18.84,64.25 v18.57,63.97
  Top 0.61: ENABLE_BLE_RESET.2 44.28,64.73 RESET.1 43.87,62.47 43.3,61.9 38.6,61.9 37.69,62.81 RESETR.2 RESET_CAP.1 | v78.2,65.5 76.7,67 v74.65,67
  Bottom 0.152: v81.2,60.4 81.2,62.05 80.7,62.55 80.7,63.95 79.15,65.5 v78.2,65.5
  Bottom 0.406: 8.24,63.97 v18.57,63.97 | 8.14,63.87 6.4,65.61 4.12,65.61 2.29,63.78 JP1.8
  Bottom 0.61: RESET.1 46.55,67 v74.65,67
RX
  Top 0.61: R2.2 UART_SELECT.2 27.44,77.55 25.25,77.55 23.88,78.92 UART_RX.1
TRACECLK  (via drill 0.2, 0.25)
  Top 0.152: 79.5,17.32 v79.38,17.2
  Top 0.254: U3.M15 90.8,58.75 91.6,57.95 v91.6,23.62 | U$11.12 87.53,12.63 87.39,12.77 86.28,13.89 82.84,17.32 79.5,17.32
  Bottom 0.61: v79.38,17.2 TRACECLK.1 v91.6,23.62
TRACEDATA0  (via drill 0.2, 0.25)
  Top 0.152: U3.M14 84.15,58.75 v83.75,59.15 | v84.95,21.1 84.95,20.98 | 88.77,14.7 88.81,14.66 | 88.81,10.18 U$11.14
  Top 0.254: 84.95,20.98 83.48,19.52 83.48,17.84 86.62,14.7 88.77,14.7 | 88.81,14.66 88.81,10.18
  Top 0.305: v88.85,56.1 88.85,22.45 v87.5,21.1
  Bottom 0.152: v83.75,59.15 88.5,59.15 88.85,58.8 v88.85,56.1
  Bottom 0.305: v87.5,21.1 v84.95,21.1
TRACEDATA1  (via drill 0.25)
  Top 0.152: 84.95,17.32 85.07,17.2 | 90.1,10.2 U$11.16
  Top 0.254: U3.N15 90.5,58.25 90.8,57.95 90.8,19.5 90.1,18.8 v87.55,18.8 | v84.95,18.8 84.95,17.32 | 85.07,17.2 86.66,15.61 89.93,15.61 90.1,15.43 90.1,10.2
  Bottom 0.254: v87.55,18.8 v84.95,18.8
TRACEDATA2  (via drill 0.2, 0.25)
  Top 0.152: U3.N14 83.85,58.25 v83.75,58.35 | 85.87,17.29 85.87,17.26 | 91.3,10.21 U$11.18
  Top 0.203: 85.87,17.26 85.91,17.26 | 90.3,16.57 90.35,16.54
  Top 0.254: 85.87,17.29 85.85,49.65 84.1,51.4 v84.1,52.3 | 90.35,16.54 91.3,15.54 91.3,10.21 | 85.91,17.26 86.61,16.56 90.3,16.57
  Bottom 0.152: v83.75,58.35 83.75,58 83.5,57.75 81.6,57.75 81.3,57.45 81.3,54.5 83.5,52.3 v84.1,52.3
TRACEDATA3
  Top 0.152: 92.64,10.2 U$11.20
  Top 0.254: U3.P15 86.15,57.75 86.65,57.25 86.68,17.44 90.92,17.45 92.64,15.73 92.64,10.2
TRST  (via drill 0.2, 0.3)
  Top 0.254: v85.85,51.65 85.85,57 85.6,57.25 U3.R15
  Top 0.406: v96.03,8.29 87.06,8.29 86.15,9.2 86.15,9.9 arc-45 U$11.10
  Bottom 0.254: TRST.1 97.59,44.95 90.9,51.65 v85.85,51.65
  Bottom 0.61: v96.03,8.29 97.59,9.72 TRST.1
TX
  Top 0.61: UART_TX.1 19.71,72.16 20.4,72.85 R3.2 26.17,76.16 UART_SELECT.5
UART_RX  (2 unrouted)
  Top 0.406: SWIO.1 16.36,66.65
  Top 0.61: 4.82,58.61 8.81,58.61 24.1,74.89 27.65,74.8 UART_SELECT.3
  Bottom 0.61: JP1.3
UART_TX
  Top 0.406: UART_SELECT.6 SWCLK.1
  Bottom 0.406: SWCLK.1 JP1.5
VBIAS  (via drill 0.2, 0.25)
  Top 0.152: U3.P10 82.5,57.9 v82.95,58.35
  Top 0.254: VBIAS.2 81.61,50.41 82,50.8 v82,51.95
  Bottom 0.254: v82.95,58.35 81.6,58.35 80.7,57.45 80.7,53.25 v82,51.95
VCCM_ANA  (via drill 0.2, 0.3)
  Top 0.152: U3.P4 v79.5,58.35
  Top 0.254: M_1.13 96.7,85.15 95.6,84.05 95.6,81.7 96.65,80.65 99.6,80.65 99.8,80.45 99.8,77.05 99.65,76.9 M_2.13 96.55,76.9 v96.45,76.8
  Top 0.305: U$2.5 99.47,52.88 v99.75,52.6 | U$1.5 99.44,68.49 v99.75,68.8
  Top 0.61: C_VCCM1.1 v73.62,49.53 v73.61,49.52 | C_VCCM2.1 98.32,48.84 v98.9,49.42
  PWR 0.305: v96.45,76.8 98.15,76.8 99.75,75.2 v99.75,68.8
  PWR 0.406: VDDIO_CONN.3 93.59,79.66 94.35,78.9 94.35,77.4 94.95,76.8 v96.45,76.8
  PWR 0.61: v79.5,58.35 79.5,54.25 80.4,53.35 | 80.4,53.35 96.8,53.35 97.55,52.6 v99.75,52.6 | VCCM_ANA.1 59.64,16.97 PWRSUPPLY.2 59.65,17.06 59.65,20.85 62.1,23.3 BATT.2 62.12,26.05 USBPWR.2 62.12,47.12 64.52,49.52 v73.61,49.52 v73.62,49.53 77.68,49.53 79.5,51.35 79.5,52.65 80.4,53.35 | v99.75,52.6 99.75,50.27 v98.9,49.42 | v99.75,52.6 v99.75,68.8
VCCM_DIG  (via drill 0.2, 0.3)
  Top 0.152: U3.H6 80.25,60.75 79.85,61.15 v79.85,61.8
  Top 0.406: VCCM_DIG.2 v78.72,70.18
  PWR 0.406: v78.72,70.18 79.85,69.05 v79.85,61.8
VDD_IO  (via drill 0.3)
  Top 0.254: U3.H15 85.8,60.75 v86.1,61.05
  Top 0.406: VDDIO.2 83.39,73.17 v84.2,72.45
  PWR 0.61: VDDIO_CONN.2 79.06,77.49 v84.2,72.45 85.05,71.5 85.05,62.1 v86.1,61.05
VDDOUT  (1 unrouted)
  PWR 1.27: 4.89,55.96 4.82,46.52 22.57,46.69 22.59,46.67 22.63,41.7 25.15,39.05 47.9,39.05 49.75,37.2 49.75,34.07 POWER.2
VLCDVDD
  Top 0.254: DVDDC.2 65.72,56.22 66,56.5 68.1,56.5 68.65,57.05 68.65,58.05 69.45,58.85 76.55,58.85 77.45,59.75 U3.K1
VREF  (via drill 0.3)
  Top 0.152: U3.R10 82.5,56.6 v82.85,56.25
  Top 0.406: VREF.2 87.8,57.22 v87.8,56.15
  Bottom 0.305: v82.85,56.25 82.95,56.15 v87.8,56.15

### Text on the board
tPlace: UART | D | BLE | TRACE